# EAGLE design NixieClock (EAGLE 9.6.2)

## Sheet 1 of 4: Nixie Control And Driver
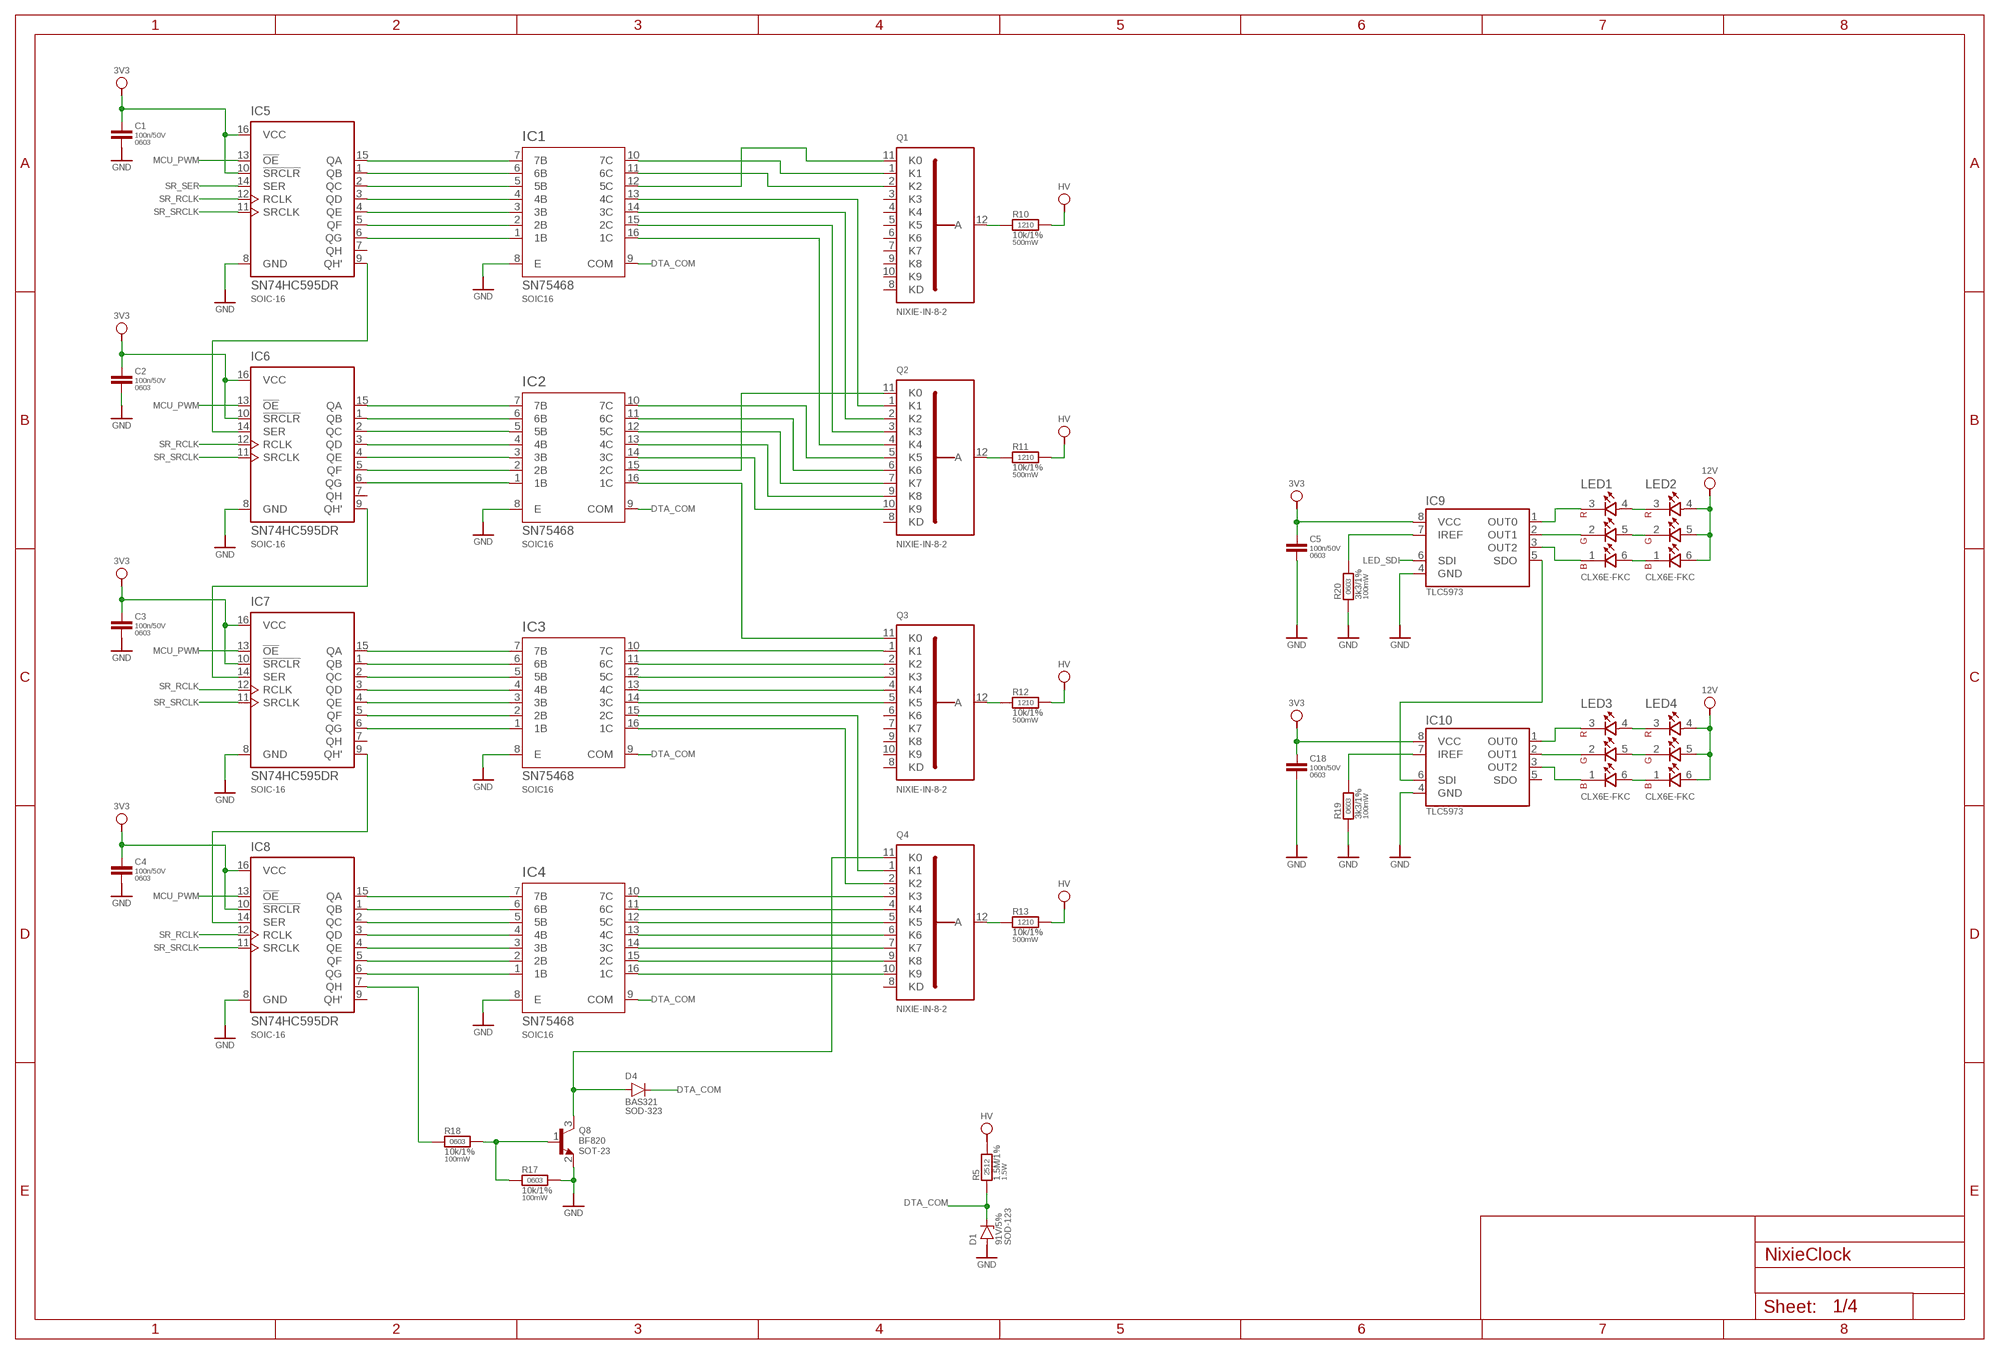
[diagram p0: schematic, sheet 1]

### Parts
C1  100n/50V  C0603C104M5RACTU  [CAPC1608X80N]
C2  100n/50V  C0603C104M5RACTU  [CAPC1608X80N]
C3  100n/50V  C0603C104M5RACTU  [CAPC1608X80N]
C4  100n/50V  C0603C104M5RACTU  [CAPC1608X80N]
C5  100n/50V  C0603C104M5RACTU  [CAPC1608X80N]
C18  100n/50V  C0603C104M5RACTU  [CAPC1608X80N]
D1  91V/5%  MMSZ5270BT1G  [SOD3716X135N]
D4  BAS321  [SOD2512X110N]
IC1  SN75468  [SOIC127P600X175-16N]
IC2  SN75468  [SOIC127P600X175-16N]
IC3  SN75468  [SOIC127P600X175-16N]
IC4  SN75468  [SOIC127P600X175-16N]
IC5  SN74HC595DR  [SOIC127P600X175-16N]
IC6  SN74HC595DR  [SOIC127P600X175-16N]
IC7  SN74HC595DR  [SOIC127P600X175-16N]
IC8  SN74HC595DR  [SOIC127P600X175-16N]
IC9  TLC5973  [SOIC127P600X175-8N]
IC10  TLC5973  [SOIC127P600X175-8N]
LED1  CLX6E-FKC  [CLX6E-FKC]
LED2  CLX6E-FKC  [CLX6E-FKC]
LED3  CLX6E-FKC  [CLX6E-FKC]
LED4  CLX6E-FKC  [CLX6E-FKC]
Q1  NIXIE-IN-8-2  [NIXIE-IN-8-2]
Q2  NIXIE-IN-8-2  [NIXIE-IN-8-2]
Q3  NIXIE-IN-8-2  [NIXIE-IN-8-2]
Q4  NIXIE-IN-8-2  [NIXIE-IN-8-2]
Q8  BF820  [SOT95P230X110-3N]
R5  1.5M/1%  MCPWR12FTEA1504  [RESC6331X65N]
R10  10k/1%  CRCW121010K0FKEA  [RESC3225X60N]
R11  10k/1%  CRCW121010K0FKEA  [RESC3225X60N]
R12  10k/1%  CRCW121010K0FKEA  [RESC3225X60N]
R13  10k/1%  CRCW121010K0FKEA  [RESC3225X60N]
R17  10k/1%  CRCW060310K0FKEA  [RESC1608X50N]
R18  10k/1%  CRCW060310K0FKEA  [RESC1608X50N]
R19  3k3/1%  MCWR06X3301FTL  [RESC1608X50N]
R20  3k3/1%  MCWR06X3301FTL  [RESC1608X50N]

### Nets
3V3: C1.1 C2.1 C3.1 C4.1 C5.1 C18.1 IC5.10(!SRCLR) IC5.16(VCC) IC6.10(!SRCLR) IC6.16(VCC) IC7.10(!SRCLR) IC7.16(VCC) IC8.10(!SRCLR) IC8.16(VCC) IC9.8(VCC) IC10.8(VCC) ; also sheet 2
12V: LED2.4(ARED) LED2.5(AGREEN) LED2.6(ABLUE) LED4.4(ARED) LED4.5(AGREEN) LED4.6(ABLUE) ; also sheet 2,3
DTA_COM: D1.1 D4.1 IC1.9(COM) IC2.9(COM) IC3.9(COM) IC4.9(COM) R5.1
GND: C1.2 C2.2 C3.2 C4.2 C5.2 C18.2 D1.2 IC1.8(E) IC2.8(E) IC3.8(E) IC4.8(E) IC5.8(GND) IC6.8(GND) IC7.8(GND) IC8.8(GND) IC9.4(GND) IC10.4(GND) Q8.2(E) R17.2 R19.1 R20.1 ; also sheet 2,3,4
HV: R5.2 R10.2 R11.2 R12.2 R13.2 ; also sheet 3
LED_SDI: IC9.6(SDI) ; also sheet 2
MCU_PWM: IC5.13(!OE) IC6.13(!OE) IC7.13(!OE) IC8.13(!OE) ; also sheet 2
N$1: IC1.7(7B) IC5.15(QA)
N$2: IC1.6(6B) IC5.1(QB)
N$3: IC1.5(5B) IC5.2(QC)
N$4: IC1.4(4B) IC5.3(QD)
N$5: IC1.3(3B) IC5.4(QE)
N$6: IC1.2(2B) IC5.5(QF)
N$7: IC1.1(1B) IC5.6(QG)
N$8: IC5.9(QH') IC6.14(SER)
N$9: IC1.10(7C) Q1.1(K1)
N$10: IC1.11(6C) Q1.2(K2)
N$11: IC1.12(5C) Q1.11(K0)
N$12: IC1.13(4C) Q2.1(K1)
N$13: IC1.14(3C) Q2.2(K2)
N$14: IC1.15(2C) Q2.3(K3)
N$15: IC1.16(1C) Q2.4(K4)
N$16: IC6.9(QH') IC7.14(SER)
N$17: IC2.10(7C) Q2.5(K5)
N$18: IC2.11(6C) Q2.6(K6)
N$19: IC2.12(5C) Q2.7(K7)
N$20: IC2.13(4C) Q2.9(K8)
N$21: IC2.14(3C) Q2.10(K9)
N$22: IC2.15(2C) Q2.11(K0)
N$23: IC2.7(7B) IC6.15(QA)
N$24: IC7.9(QH') IC8.14(SER)
N$25: IC2.6(6B) IC6.1(QB)
N$26: IC2.5(5B) IC6.2(QC)
N$27: IC2.4(4B) IC6.3(QD)
N$28: IC2.3(3B) IC6.4(QE)
N$29: IC2.2(2B) IC6.5(QF)
N$30: IC2.1(1B) IC6.6(QG)
N$31: IC3.7(7B) IC7.15(QA)
N$32: IC3.6(6B) IC7.1(QB)
N$33: IC3.5(5B) IC7.2(QC)
N$34: IC3.4(4B) IC7.3(QD)
N$35: IC3.3(3B) IC7.4(QE)
N$36: IC3.2(2B) IC7.5(QF)
N$37: IC3.1(1B) IC7.6(QG)
N$38: IC8.7(QH) R18.1
N$39: IC9.1(OUT0) LED1.3(CRED)
N$40: IC9.3(OUT2) LED1.1(CBLUE)
N$41: IC9.2(OUT1) LED1.2(CGREEN)
N$42: IC4.11(6C) Q4.4(K4)
N$43: IC10.1(OUT0) LED3.3(CRED)
N$44: IC4.7(7B) IC8.15(QA)
N$45: IC4.6(6B) IC8.1(QB)
N$46: IC4.5(5B) IC8.2(QC)
N$47: IC4.4(4B) IC8.3(QD)
N$48: IC4.3(3B) IC8.4(QE)
N$49: IC4.2(2B) IC8.5(QF)
N$50: IC4.1(1B) IC8.6(QG)
N$51: IC2.16(1C) Q3.11(K0)
N$52: IC3.14(3C) Q3.5(K5)
N$53: IC3.13(4C) Q3.4(K4)
N$54: IC3.12(5C) Q3.3(K3)
N$55: Q1.12(A) R10.1
N$57: IC3.11(6C) Q3.2(K2)
N$58: IC3.10(7C) Q3.1(K1)
N$59: IC3.15(2C) Q4.1(K1)
N$60: IC3.16(1C) Q4.2(K2)
N$61: IC4.10(7C) Q4.3(K3)
N$62: IC4.12(5C) Q4.5(K5)
N$63: IC4.13(4C) Q4.6(K6)
N$64: IC4.14(3C) Q4.7(K7)
N$65: Q8.1(B) R17.1 R18.2
N$66: IC4.15(2C) Q4.9(K8)
N$67: IC4.16(1C) Q4.10(K9)
N$68: D4.2 Q4.11(K0) Q8.3(C)
N$69: IC10.2(OUT1) LED3.2(CGREEN)
N$73: IC10.3(OUT2) LED3.1(CBLUE)
N$74: Q2.12(A) R11.1
N$75: Q3.12(A) R12.1
N$76: Q4.12(A) R13.1
N$82: LED3.4(ARED) LED4.3(CRED)
N$84: LED3.5(AGREEN) LED4.2(CGREEN)
N$85: LED3.6(ABLUE) LED4.1(CBLUE)
N$86: LED1.4(ARED) LED2.3(CRED)
N$87: LED1.5(AGREEN) LED2.2(CGREEN)
N$88: LED1.6(ABLUE) LED2.1(CBLUE)
N$90: IC9.7(IREF) R20.2
N$91: IC10.7(IREF) R19.2
N$93: IC9.5(SDO) IC10.6(SDI)
SR_RCLK: IC5.12(RCLK) IC6.12(RCLK) IC7.12(RCLK) IC8.12(RCLK) ; also sheet 2
SR_SER: IC5.14(SER) ; also sheet 2
SR_SRCLK: IC5.11(SRCLK) IC6.11(SRCLK) IC7.11(SRCLK) IC8.11(SRCLK) ; also sheet 2
Unconnected: IC5.7(QH) IC6.7(QH) IC7.7(QH) IC8.9(QH') IC10.5(SDO) Q1.3(K3) Q1.4(K4) Q1.5(K5) Q1.6(K6) Q1.7(K7) Q1.8(KD) Q1.9(K8) Q1.10(K9) Q2.8(KD) Q3.6(K6) Q3.7(K7) Q3.8(KD) Q3.9(K8) Q3.10(K9) Q4.8(KD)

## Sheet 2 of 4: MCU And Connectors
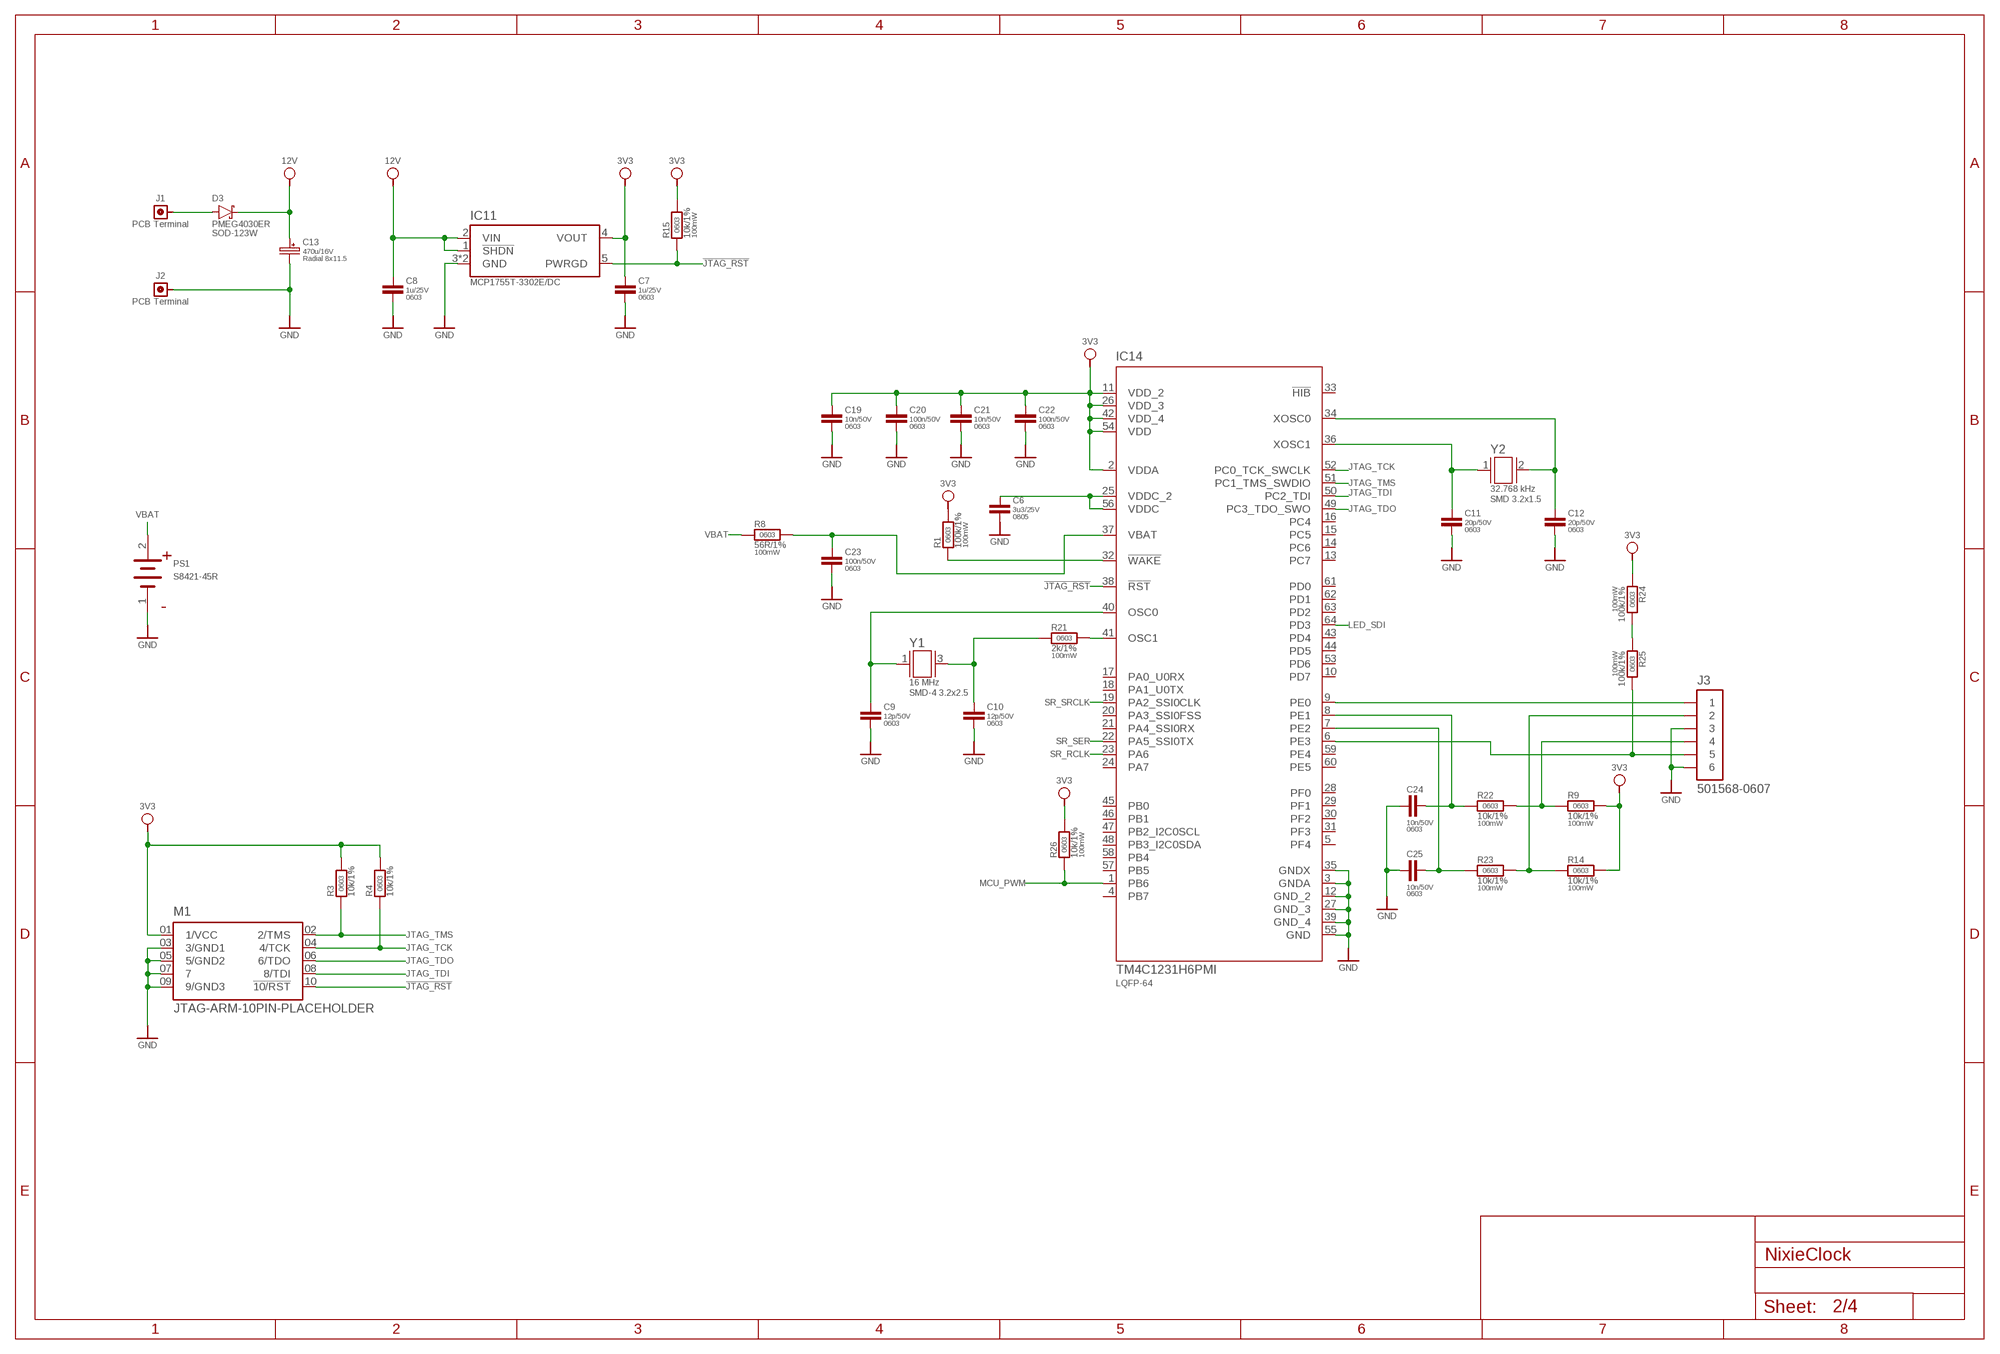
[diagram p1: schematic, sheet 2]

### Parts
C6  3u3/25V  C2012X7R1E335K125  [CAPC2012X145N]
C7  1u/25V  CL10A105KA8NNNC  [CAPC1608X80N]
C8  1u/25V  CL10A105KA8NNNC  [CAPC1608X80N]
C9  12p/50V  C0603C120J5GACTU  [CAPC1608X80N]
C10  12p/50V  C0603C120J5GACTU  [CAPC1608X80N]
C11  20p/50V  C0603C200J1GACTU  [CAPC1608X80N]
C12  20p/50V  C0603C200J1GACTU  [CAPC1608X80N]
C13  470u/16V  ECA1CM471  [CAPPRD350W60D800H1150B]
C19  10n/50V  C0603C103K5RACTU  [CAPC1608X80N]
C20  100n/50V  C0603C104M5RACTU  [CAPC1608X80N]
C21  10n/50V  C0603C103K5RACTU  [CAPC1608X80N]
C22  100n/50V  C0603C104M5RACTU  [CAPC1608X80N]
C23  100n/50V  C0603C104M5RACTU  [CAPC1608X80N]
C24  10n/50V  C0603C103K5RACTU  [CAPC1608X80N]
C25  10n/50V  C0603C103K5RACTU  [CAPC1608X80N]
D3  PMEG4030ER  PMEG4010CEJ  [SODFL3517X110N]
IC11  MCP1755T-3302E/DC  [SOT127P700X180-6N]
IC14  TM4C1231H6PMI  [QFP50P1200X1200X160-64N]
J1  PCB Terminal  PCB_TERMINAL_PAD  [PCB_TERMINAL_PAD]
J2  PCB Terminal  PCB_TERMINAL_PAD  [PCB_TERMINAL_PAD]
J3  501568-0607  MOLEX_501568-0607  [MOLEX_501568-0607]
M1  JTAG-ARM-10PIN-PLACEHOLDER  [JTAG-ARM-10PIN-PLACEHOLDER]
PS1  S8421-45R  [S8421-45R]
R1  100k/1%  CRCW0603100KFKEA  [RESC1608X50N]
R3  10k/1%  CRCW060310K0FKEA  [RESC1608X50N]
R4  10k/1%  CRCW060310K0FKEA  [RESC1608X50N]
R8  56R/1%  CRCW060356R0FKEA  [RESC1608X50N]
R9  10k/1%  CRCW060310K0FKEA  [RESC1608X50N]
R14  10k/1%  CRCW060310K0FKEA  [RESC1608X50N]
R15  10k/1%  CRCW060310K0FKEA  [RESC1608X50N]
R21  2k/1%  CRCW06032K00FKEA  [RESC1608X50N]
R22  10k/1%  CRCW060310K0FKEA  [RESC1608X50N]
R23  10k/1%  CRCW060310K0FKEA  [RESC1608X50N]
R24  100k/1%  CRCW0603100KFKEA  [RESC1608X50N]
R25  100k/1%  CRCW0603100KFKEA  [RESC1608X50N]
R26  10k/1%  CRCW060310K0FKEA  [RESC1608X50N]
Y1  16 MHz  MCSJK-7U-16.00-10-10-80-B-10  [OSCCC320X250X100N]
Y2  32.768 kHz  ABS07AIG-32.768KHZ-1-T  [OSCCC320X150X90N]

### Nets
3V3: C7.1 C19.1 C20.1 C21.1 C22.1 IC11.4(VOUT) IC14.2(VDDA) IC14.11(VDD_2) IC14.26(VDD_3) IC14.42(VDD_4) IC14.54(VDD) M1.01(1/VCC) R1.2 R3.2 R4.2 R9.2 R14.2 R15.2 R24.1 R26.2 ; also sheet 1
12V: C8.1 C13.1 D3.1 IC11.1(!SHDN) IC11.2(VIN) ; also sheet 1,3
!JTAG_RST: IC11.5(PWRGD) IC14.38(!RST) M1.10(!10/RST) R15.1
!WAKE: IC14.32(!WAKE) R1.1
GND: C6.2 C7.2 C8.2 C9.2 C10.2 C11.2 C12.2 C13.2 C19.2 C20.2 C21.2 C22.2 C23.2 C24.1 C25.1 IC11.3(GND) IC11.6(GND) IC14.3(GNDA) IC14.12(GND_2) IC14.27(GND_3) IC14.35(GNDX) IC14.39(GND_4) IC14.55(GND) J2.1 J3.3 J3.6 M1.03(3/GND1) M1.05(5/GND2) M1.07 M1.09(9/GND3) PS1.1(CATHODE) ; also sheet 1,3,4
JTAG_TCK: IC14.52(PC0_TCK_SWCLK) M1.04(4/TCK) R4.1
JTAG_TDI: IC14.50(PC2_TDI) M1.08(8/TDI)
JTAG_TDO: IC14.49(PC3_TDO_SWO) M1.06(6/TDO)
JTAG_TMS: IC14.51(PC1_TMS_SWDIO) M1.02(2/TMS) R3.1
LED_SDI: IC14.64(PD3) ; also sheet 1
MCU_LS: IC14.6(PE3) J3.5 R25.2
MCU_PWM: IC14.1(PB6) R26.1 ; also sheet 1
MCU_QEA: C24.2 IC14.8(PE1) R22.1
MCU_QEB: C25.2 IC14.7(PE2) R23.1
MCU_SW: IC14.9(PE0) J3.1
MCU_VBAT: C23.1 IC14.37(VBAT) R8.2
MCU_VDDC: C6.1 IC14.25(VDDC_2) IC14.56(VDDC)
N$71: R24.2 R25.1
N$89: IC14.41(OSC1) R21.2
OSC0: C9.1 IC14.40(OSC0) Y1.1
OSC1: C10.1 R21.1 Y1.3
QEA_RAW: J3.4 R9.1 R22.2
QEB_RAW: J3.2 R14.1 R23.2
SR_RCLK: IC14.23(PA6) ; also sheet 1
SR_SER: IC14.22(PA5_SSI0TX) ; also sheet 1
SR_SRCLK: IC14.19(PA2_SSI0CLK) ; also sheet 1
VBAT: PS1.2(ANODE) R8.1
VSUPP [Supply]: D3.2 J1.1
XOSC0: C12.1 IC14.34(XOSC0) Y2.2
XOSC1: C11.1 IC14.36(XOSC1) Y2.1
Unconnected: IC14.4(PB7) IC14.5(PF4) IC14.10(PD7) IC14.13(PC7) IC14.14(PC6) IC14.15(PC5) IC14.16(PC4) IC14.17(PA0_U0RX) IC14.18(PA1_U0TX) IC14.20(PA3_SSI0FSS) IC14.21(PA4_SSI0RX) IC14.24(PA7) IC14.28(PF0) IC14.29(PF1) IC14.30(PF2) IC14.31(PF3) IC14.33(!HIB) IC14.43(PD4) IC14.44(PD5) IC14.45(PB0) IC14.46(PB1) IC14.47(PB2_I2C0SCL) IC14.48(PB3_I2C0SDA) IC14.53(PD6) IC14.57(PB5) IC14.58(PB4) IC14.59(PE4) IC14.60(PE5) IC14.61(PD0) IC14.62(PD1) IC14.63(PD2)

## Sheet 3 of 4: High Voltage Supply
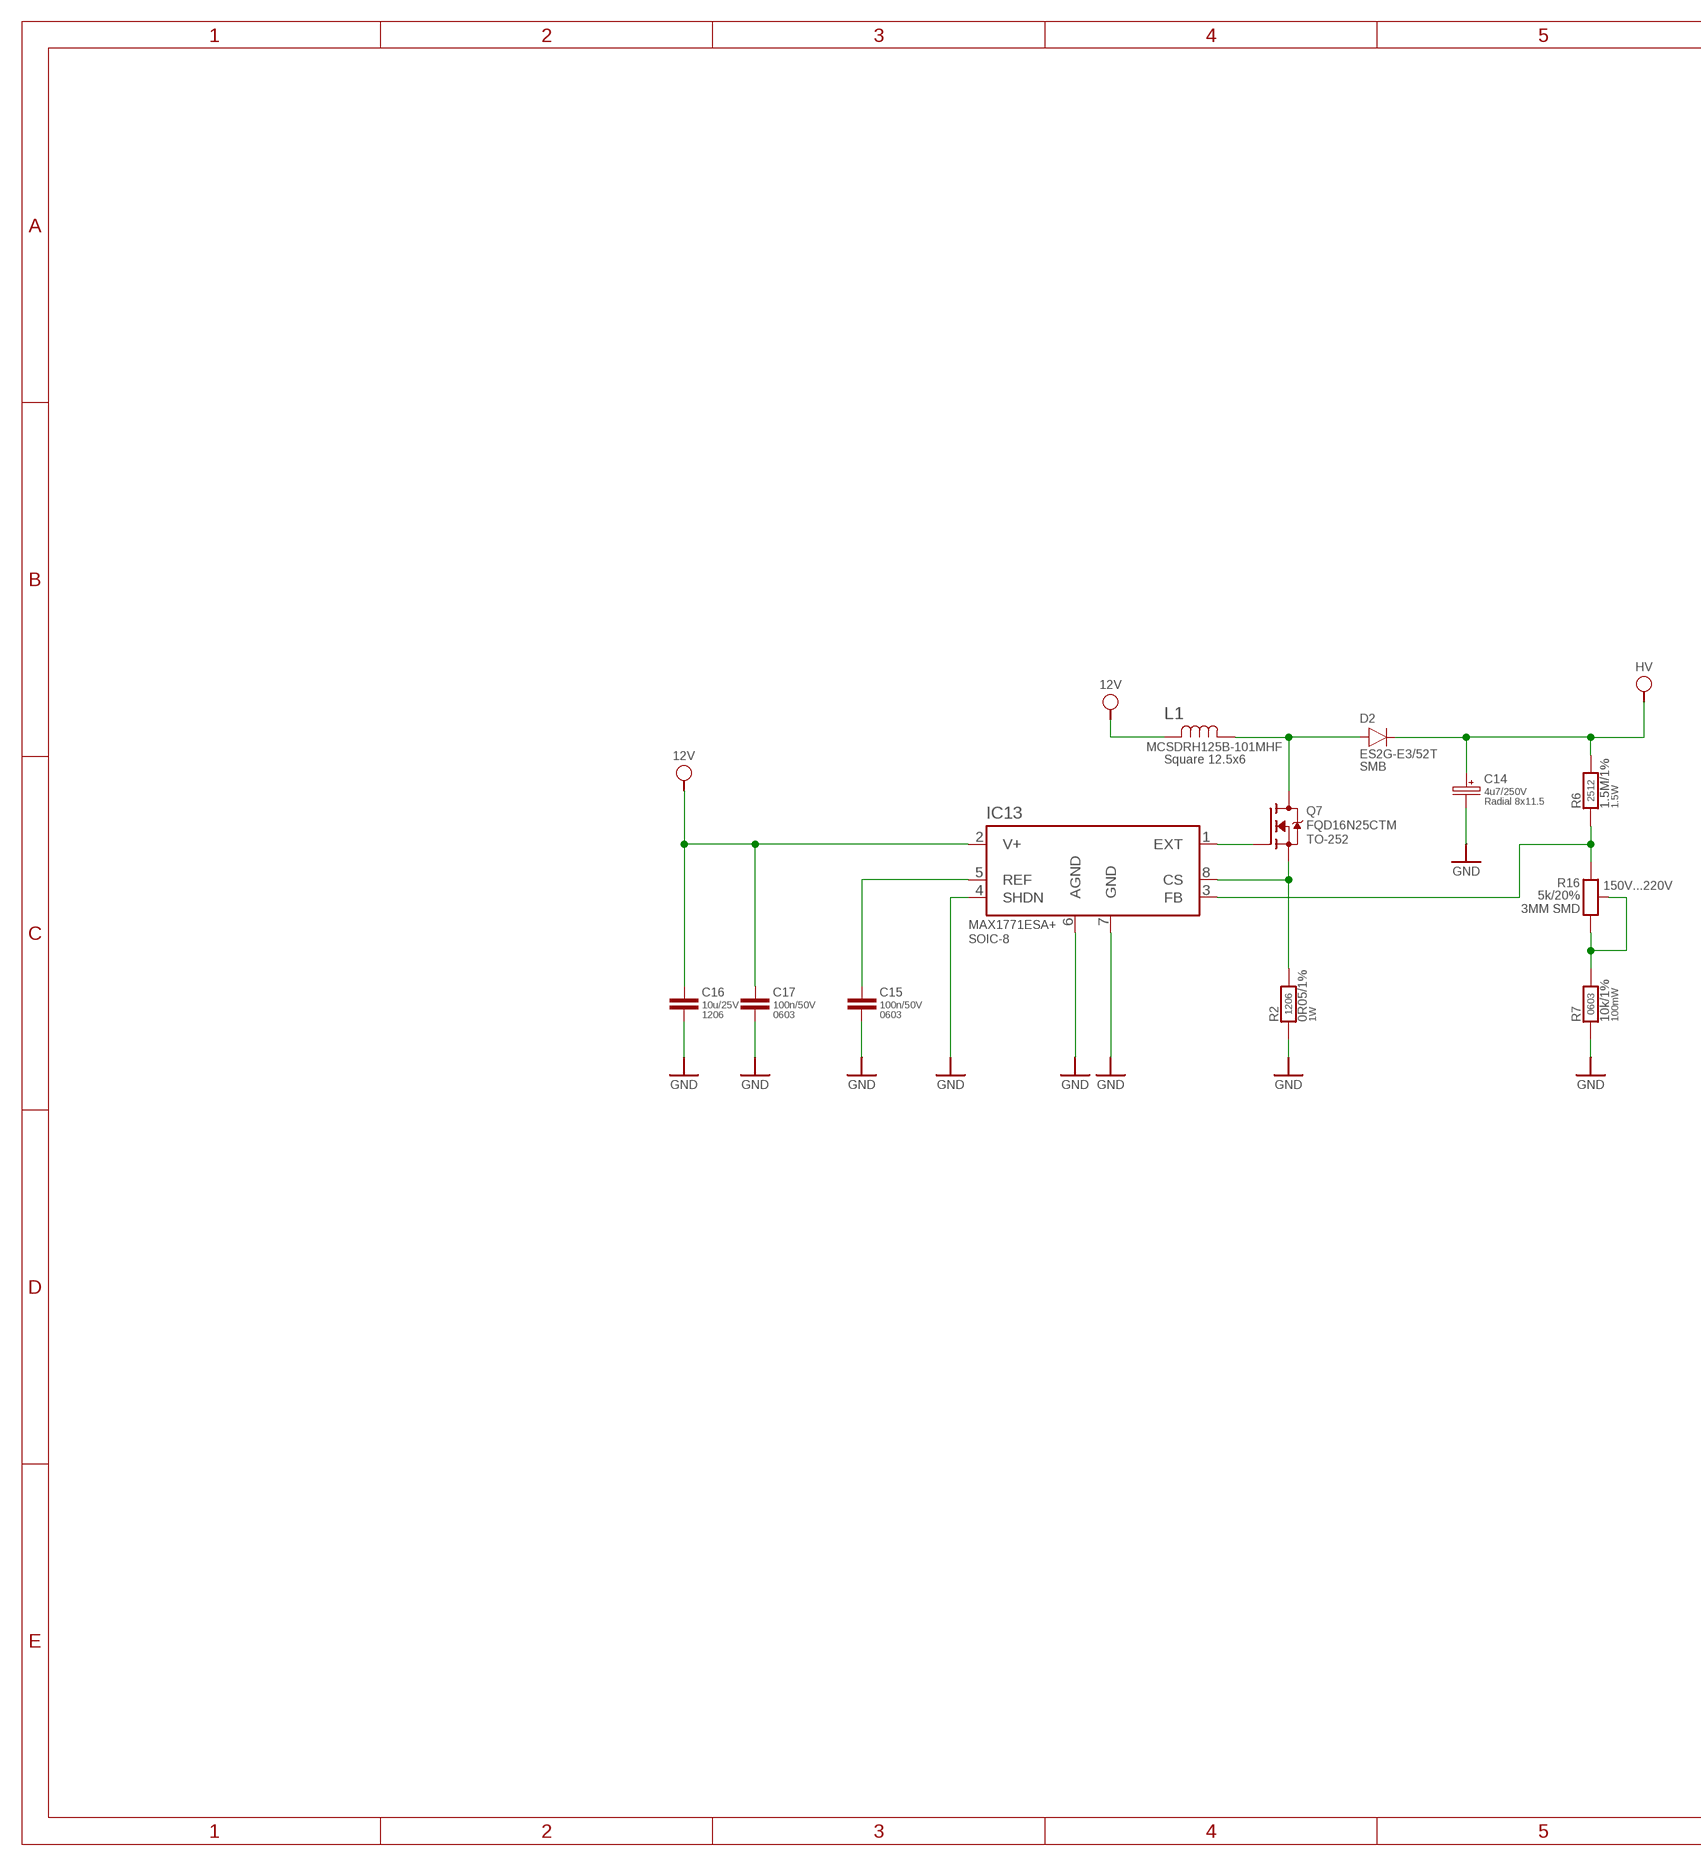
[diagram p2: schematic, sheet 3, part 1 of 2]
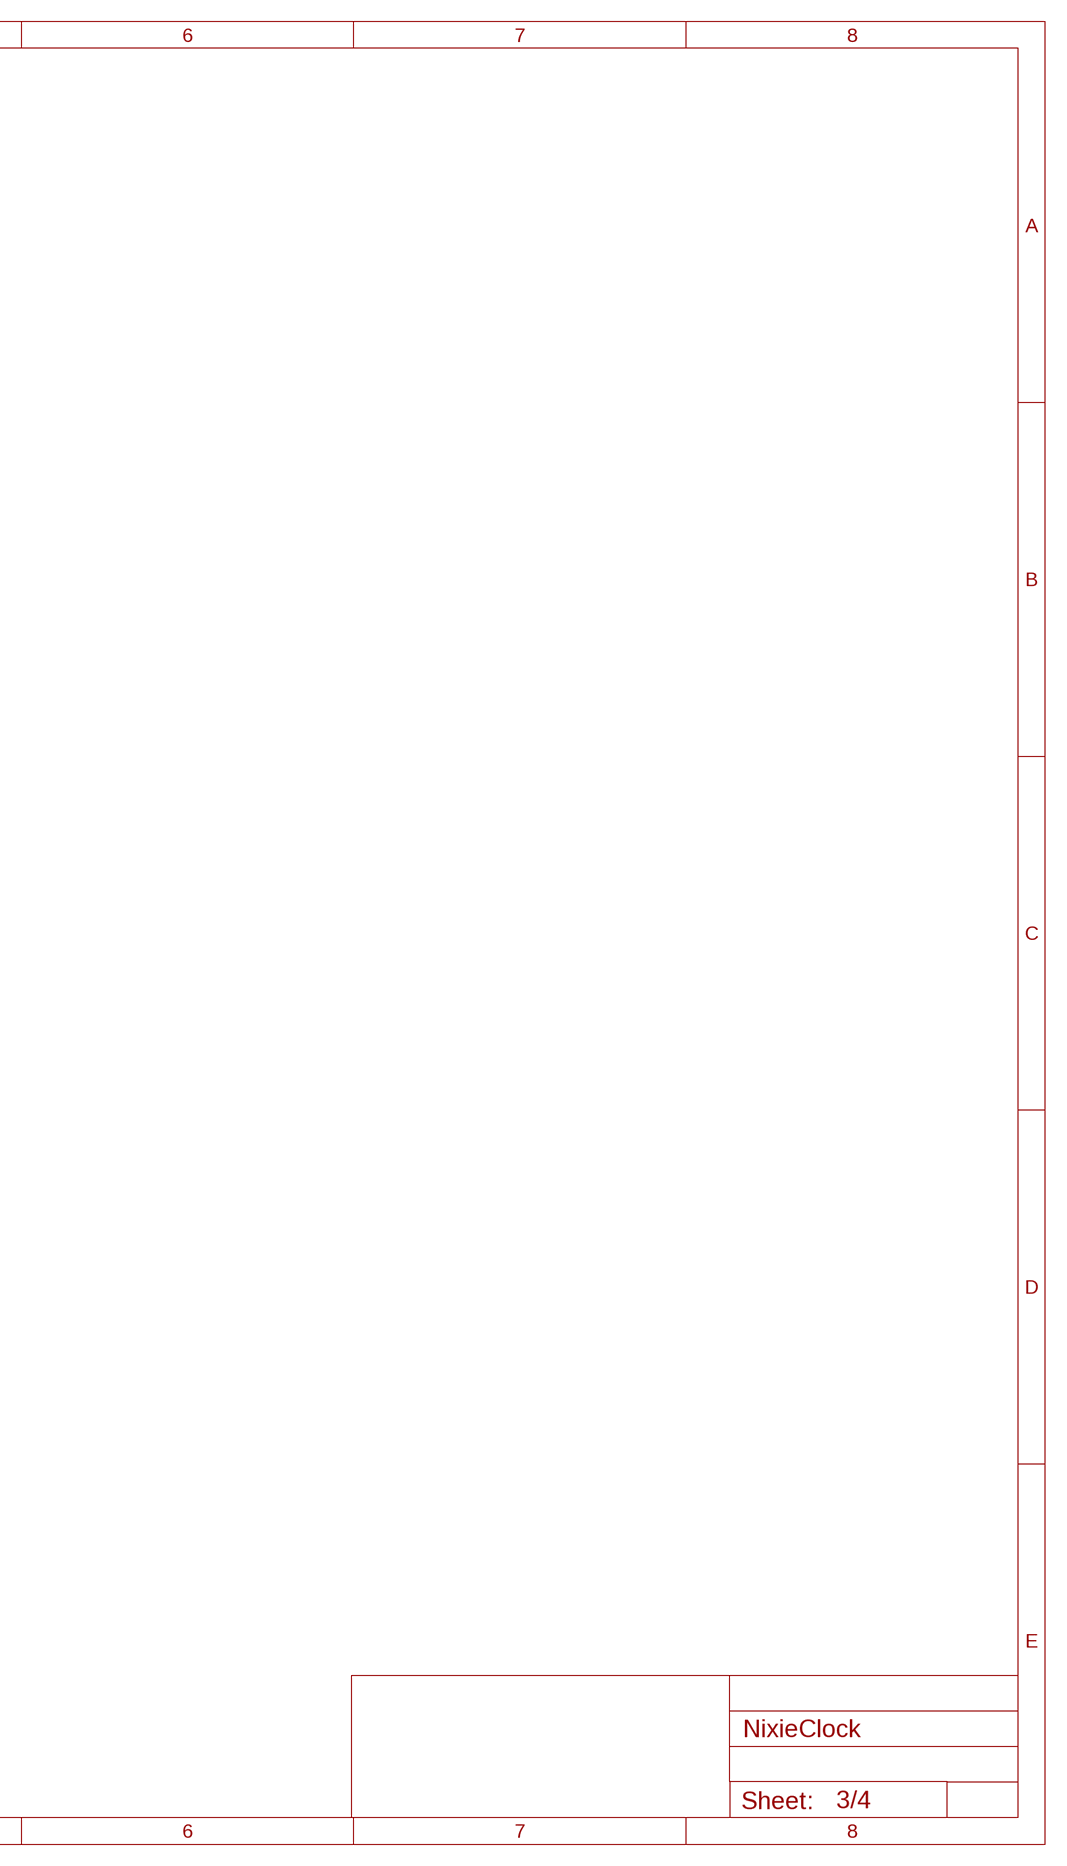
[diagram p3: schematic, sheet 3, part 2 of 2]

### Parts
C14  4u7/250V  ECA2EHG4R7  [CAPPRD350W60D800H1150B]
C15  100n/50V  C0603C104M5RACTU  [CAPC1608X80N]
C16  10u/25V  C1206C106K3PACTU  [CAPC3216X170N]
C17  100n/50V  C0603C104M5RACTU  [CAPC1608X80N]
D2  ES2G-E3/52T  [DIOM5436X245N]
IC13  MAX1771ESA+  [SOIC127P600X175-8N]
L1  MCSDRH125B-101MHF  [INDM120120X600N]
Q7  FQD16N25CTM  [TO230P990X240-3N]
R2  0R05/1%  ERJ8CWFR050V  [RESC3216X70N]
R6  1.5M/1%  MCPWR12FTEA1504  [RESC6331X65N]
R7  10k/1%  CRCW060310K0FKEA  [RESC1608X50N]
R16  5k/20%  22AR5K  [22A]

### Nets
12V: C16.1 C17.1 IC13.2(V+) L1.1 ; also sheet 1,2
CS: IC13.8(CS) Q7.3(S) R2.2
FB: IC13.3(FB) R6.1 R16.P$1
GND: C14.2 C15.2 C16.2 C17.2 IC13.4(SHDN) IC13.6(AGND) IC13.7(GND) R2.1 R7.1 ; also sheet 1,2,4
HV: C14.1 D2.1 R6.2 ; also sheet 1
N$56: IC13.1(EXT) Q7.1(G)
N$83: R7.2 R16.P$2 R16.P$3
REF: C15.1 IC13.5(REF)
SW: D2.2 L1.2 Q7.4(D)

### Notes on the sheet
- 150V...220V

## Sheet 4 of 4: Miscellaneous
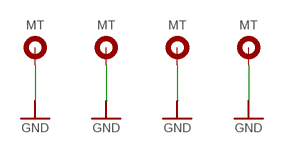
[diagram p4: schematic, sheet 4]

### Parts
MT1  MOUNTING_HOLE_3MM  [MOUNTING_HOLE_3MM]
MT2  MOUNTING_HOLE_3MM  [MOUNTING_HOLE_3MM]
MT3  MOUNTING_HOLE_3MM  [MOUNTING_HOLE_3MM]
MT4  MOUNTING_HOLE_3MM  [MOUNTING_HOLE_3MM]

### Nets
GND: MT1.0(GND) MT1.1(GND) MT1.2(GND) MT1.3(GND) MT1.4(GND) MT1.5(GND) MT1.6(GND) MT1.7(GND) MT1.8(GND) MT2.0(GND) MT2.1(GND) MT2.2(GND) MT2.3(GND) MT2.4(GND) MT2.5(GND) MT2.6(GND) MT2.7(GND) MT2.8(GND) MT3.0(GND) MT3.1(GND) MT3.2(GND) MT3.3(GND) MT3.4(GND) MT3.5(GND) MT3.6(GND) MT3.7(GND) MT3.8(GND) MT4.0(GND) MT4.1(GND) MT4.2(GND) MT4.3(GND) MT4.4(GND) MT4.5(GND) MT4.6(GND) MT4.7(GND) MT4.8(GND) ; also sheet 1,2,3

## Library data of the parts
C1-C5 C15 C17 C18 C20 C22 C23 = Capacitors:C0603C104M5RACTU: SMT Capacitor, 100n/50V, X7R, 10%, 0603, KEMET; MANUFACTURER: KEMET; PACKAGE: 0603; PARAMETER: X7R, 20%; PARTNUMBER: C0603C104M5RACTU
C6 = Capacitors:C2012X7R1E335K125: SMT Capacitor, 3u3/25V, X7R, 10%, 0805, TDK; MANUFACTURER: TDK; PACKAGE: 0805; PARAMETER: X7R, 10%; PARTNUMBER: C2012X7R1E335K125AB
C7 C8 = Capacitors:CL10A105KA8NNNC: SMT Capacitor, 1u/25V, X7R, 10%, 0603, SAMSUNG ELECTRO-MECHANICS; MANUFACTURER: SAMSUNG ELECTRO-MECHANICS; PACKAGE: 0603; PARAMETER: X7R, 10%; PARTNUMBER: CL10A105KA8NNNC
C9 C10 = Capacitors:C0603C120J5GACTU: SMT Capacitor, 12p/50V, C0G/NP0, ±5%, 0603, KEMET; MANUFACTURER: KEMET; PACKAGE: 0603; PARAMETER: C0G/NP0, ±5%; PARTNUMBER: C0603C120J5GACTU
C11 C12 = Capacitors:C0603C200J1GACTU: SMT Capacitor, 20p/50V, C0G/NP0, ±5%, 0603, KEMET; MANUFACTURER: KEMET; PACKAGE: 0603; PARAMETER: C0G/NP0, ±5%; PARTNUMBER: C0603C200J1GACTU
C13 = Capacitors:ECA1CM471: Electrolytic Capacitor, 470 µF, 16 V, ± 20%, Radial Leaded, Panasonic; MANUFACTURER: Panasonic; PACKAGE: Radial 8x11.5; PARAMETER: Alu, 20%; PARTNUMBER: ECA1CM471
C14 = Capacitors:ECA2EHG4R7: Electrolytic Capacitor, 4.7 µF, 250 V, ± 20%, Radial Leaded, Panasonic; MANUFACTURER: Panasonic; PACKAGE: Radial 8x11.5; PARAMETER: Alu, 20%; PARTNUMBER: ECA2EHG4R7
C16 = Capacitors:C1206C106K3PACTU: SMT Capacitor, 10u/25V, X5R, ±10%, 1206, KEMET; MANUFACTURER: KEMET; PACKAGE: 1206; PARAMETER: X5R; PARTNUMBER: C1206C106K3PACTU
C19 C21 C24 C25 = Capacitors:C0603C103K5RACTU: SMT Capacitor, 10n/50V, X7R, 10%, 0603, KEMET; MANUFACTURER: KEMET; PACKAGE: 0603; PARAMETER: X7R, 10%; PARTNUMBER: C0603C103K5RACTU
D1 = Diodes:MMSZ5270BT1G: Zener Diode, Voltage Regulator, 91 V, 500 mW, 5 %, SOD-123, ON Semiconductor; MANUFACTURER: ON Semiconductor; PACKAGE: SOD-123; PARAMETER: 500mW; PARTNUMBER: MMSZ5270BT1G
D2 = Diodes:ES2G-E3/52T: Fast / Ultrafast Diode, 400 V, 2 A, 900 mV, 35 ns, 50 A, SMB, VISHAY; MANUFACTURER: VISHAY; PACKAGE: SMB; PARAMETER: 400V/2A; PARTNUMBER: ES2G-E3/52T
D3 = Diodes:PMEG4010CEJ: Schottky Rectifier, 40 V, 3 A, 540 mV, SOD-123W, NEXPERIA; MANUFACTURER: NEXPERIA; PACKAGE: SOD-123W; PARAMETER: 40V, 3A; PARTNUMBER: PMEG4030ER,115
D4 = Diodes:BAS321: Small Signal Diode, 250 V, 250 mA, 1.25 V, 50 ns, 9 A; MANUFACTURER: NEXPERIA; PACKAGE: SOD-323; PARAMETER: 250V, 250mA; PARTNUMBER: BAS321/8F
IC1-IC4 = ICs:SN75468: 100-V, 7-ch darlington array with TTL or CMOS compatibility; MANUFACTURER: Texas Instruments; PACKAGE: SOIC16; PARTNUMBER: SN75468D
IC5-IC8 = ICs:SN74HC595DR: 8-Bit Shift Register With 3-State Outputs; MANUFACTURER: Texas Instruments; PACKAGE: SOIC-16; PARTNUMBER: SN74HC595DR
IC9 IC10 = ICs:TLC5973: LED Driver, 3-Channel, 12-Bit, PWM Constant-Current with Single-Wire Interface, Texas Instruments; MANUFACTURER: Texas Instruments; PACKAGE: SOIC-8; PARTNUMBER: TLC5973
IC11 = ICs:MCP1755T-3302E/DC: Fixed LDO Voltage Regulator, 3.6V to 16V, 300mV Dropout, 3.3Vout, 300mAout, SOT-223-5, MICROCHIP; MANUFACTURER: MICROCHIP; PACKAGE: SOT-223-5; PARTNUMBER: MCP1755T-3302E/DC
IC13 = ICs:MAX1771ESA+: DC/DC Controller, Boost (Step Up), 3 V to 16.5 V, 1 Output, 300 kHz, SOIC-8; MANUFACTURER: Maxim Integrated; PACKAGE: SOIC-8; PARTNUMBER: MAX1771ESA+
IC14 = ICs:TM4C1231H6PMI; MANUFACTURER: Texas Instruments; PACKAGE: LQFP-64; PARTNUMBER: TM4C1231H6PMI
J1 J2 = Connectors:PCB_TERMINAL_PAD; PARAMETER: 4mmx2mm
J3 = Connectors:MOLEX_501568-0607: PCB Header, 1.00mm Pitch, Pico-Clasp, Single Row, Right-Angle, Surface Mount, Tin Plated, with Inner Positive Lock, 6 Circuits; MANUFACTURER: MOLEX; PARTNUMBER: 501568-0607
L1 = Inductors:MCSDRH125B-101MHF: Power Inductor (SMD), 100 µH, 2.4 A, Shielded, 2.2 A, MCSDRH125B Series, 12.5mm x 12.5mm x 6mm; MANUFACTURER: Multicomp PRO; PACKAGE: Square 12.5x6; PARTNUMBER: MCSDRH125B-101MHF
LED1-LED4 = Diodes:CLX6E-FKC: LED, Red, Green, Blue, SMD, Square, R 15mA, G 10mA, B 10mA, CREE; MANUFACTURER: CREE; PACKAGE: SMD 3.5x3.4x2.8 mm; PARTNUMBER: CLX6E-FKC-CH1M1D1BB7C3D3
M1 = Connectors:JTAG-ARM-10PIN-PLACEHOLDER: JTAG 10-pin ARM compatible connector placeholder.
MT1-MT4 = Misc:MOUNTING_HOLE_3MM
PS1 = Misc:S8421-45R: Battery Holder (Open) Coin, 20.0mm 1 Cell SMD (SMT) Tab; MANUFACTURER: Harwin; PARTNUMBER: S8421-45R
Q1-Q4 = Misc:NIXIE-IN-8-2
Q7 = Transistors:FQD16N25CTM: Power MOSFET, N Channel, 250 V, 16 A, 0.22 ohm, TO-252 (DPAK), Surface Mount; MANUFACTURER: ON Semiconductor; PACKAGE: TO-252; PARTNUMBER: FQD16N25CTM
Q8 = Transistors:BF820: NPN Transistor, Bipolar (BJT), 300 V, 50 mA, 250 mW, SOT-23, NEXPERIA; MANUFACTURER: NEXPERIA; PACKAGE: SOT-23; PARTNUMBER: BF820
R1 R24 R25 = Resistors:CRCW0603100KFKEA: SMT Resistor, 100k/1%, 100mW, 0603, VISHAY; MANUFACTURER: VISHAY; PACKAGE: 0603; PARAMETER: 100mW; PARTNUMBER: CRCW0603100KFKEA
R2 = Resistors:ERJ8CWFR050V: SMD Current Sense Resistor, 0R05/1%, 1 W, 1206 [3216], Panasonic; MANUFACTURER: Panasonic; PACKAGE: 1206; PARAMETER: 1W; PARTNUMBER: ERJ8CWFR050V
R3 R4 R7 R9 R14 R15 R17 R18 R22 R23 R26 = Resistors:CRCW060310K0FKEA: SMT Resistor, 10k/1%, 100mW, 0603, VISHAY; MANUFACTURER: VISHAY; PACKAGE: 0603; PARAMETER: 100mW; PARTNUMBER: CRCW060310K0FKEA
R5 R6 = Resistors:MCPWR12FTEA1504: SMT Resistor, 1.5M, 1%, 1.5W, 2512 [6432], MULTICOMP PRO; MANUFACTURER: MULTICOMP PRO; PACKAGE: 2512; PARAMETER: 1.5W; PARTNUMBER: MCPWR12FTEA1504
R8 = Resistors:CRCW060356R0FKEA: SMT Resistor, 56R/1%, 100mW, 0603, VISHAY; MANUFACTURER: VISHAY; PACKAGE: 0603; PARAMETER: 100mW; PARTNUMBER: CRCW060333R0FKEA
R10-R13 = Resistors:CRCW121010K0FKEA: SMT Resistor, 10k/1%, 500mW, 1210, VISHAY; MANUFACTURER: VISHAY; PACKAGE: 1210; PARAMETER: 500mW; PARTNUMBER: CRCW121010K0FKEA
R16 = Resistors:22AR5K: Trimpot, Single Turn, Cermet, Top Adjust, 5 kohm, Surface Mount, 1 Turns; MANUFACTURER: TT ELECTRONICS / BI TECHNOL; PACKAGE: 3MM SMD
R19 R20 = Resistors:MCWR06X3301FTL: SMT Resistor, 3k3/1%, 100mW, 0603, MULTICOMP PRO; MANUFACTURER: MULTICOMP PRO; PACKAGE: 0603; PARAMETER: 100mW; PARTNUMBER: MCWR06X3301FTL
R21 = Resistors:CRCW06032K00FKEA: SMT Resistor, 2k/1%, 100mW, 0603, VISHAY; MANUFACTURER: VISHAY; PACKAGE: 0603; PARAMETER: 100mW; PARTNUMBER: CRCW06032K00FKEA
Y1 = Crystals:MCSJK-7U-16.00-10-10-80-B-10: SMT Crystal, 16 MHz, SMD, 3.2mm x 2.5mm, 10 ppm, 10 pF, 10 ppm; MANUFACTURER: ABRACON; PACKAGE: SMD-4 3.2x2.5; PARAMETER: ±10ppm, 10pF; PARTNUMBER: MCSJK-7U-16.00-10-10-80-B-10
Y2 = Crystals:ABS07AIG-32.768KHZ-1-T: SMT Crystal, 32.768 kHz, SMD, 3.2mm x 1.5mm, 12.5 pF, 10 ppm; MANUFACTURER: ABRACON; PACKAGE: SMD 3.2x1.5; PARAMETER: ±10 ppm, 12.5 pF; PARTNUMBER: ABS07AIG-32.768KHZ-1-T

## Net classes
1 Supply: width 1 mm

## Board
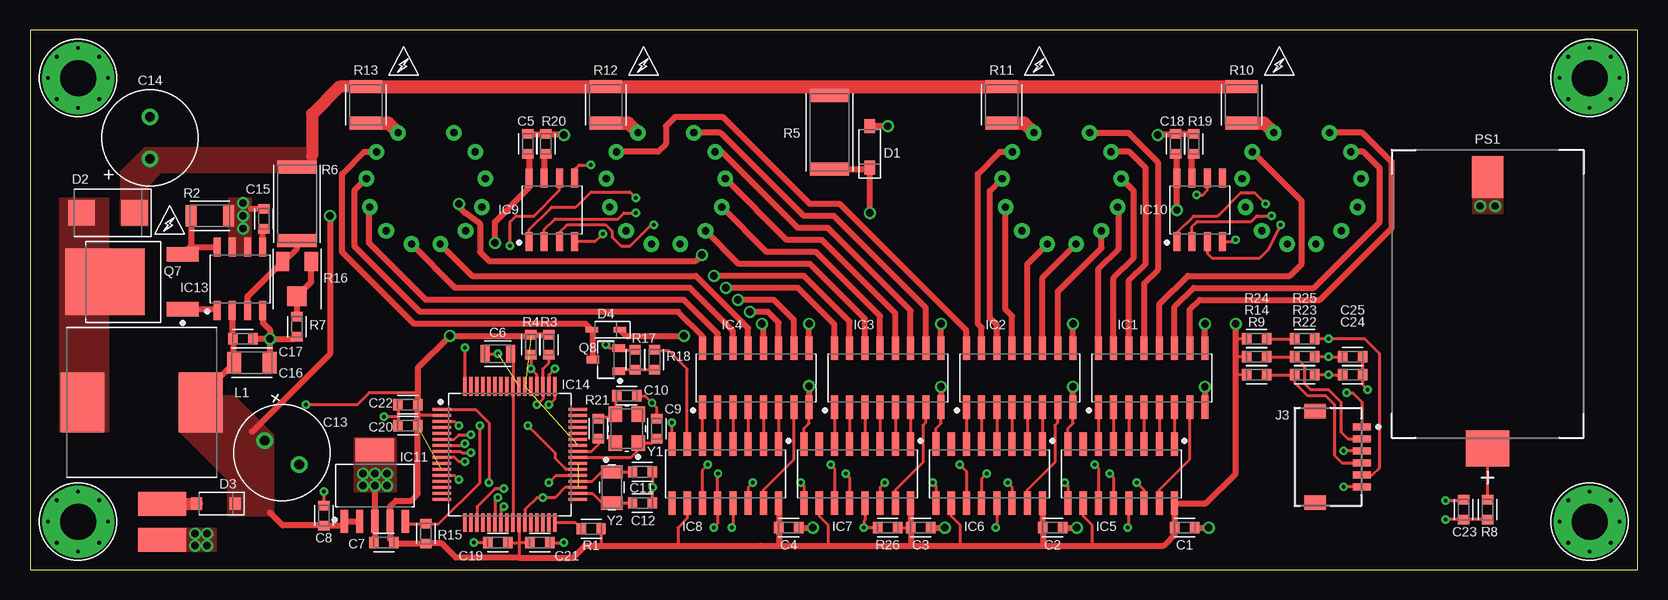
[diagram p5: board, top side]
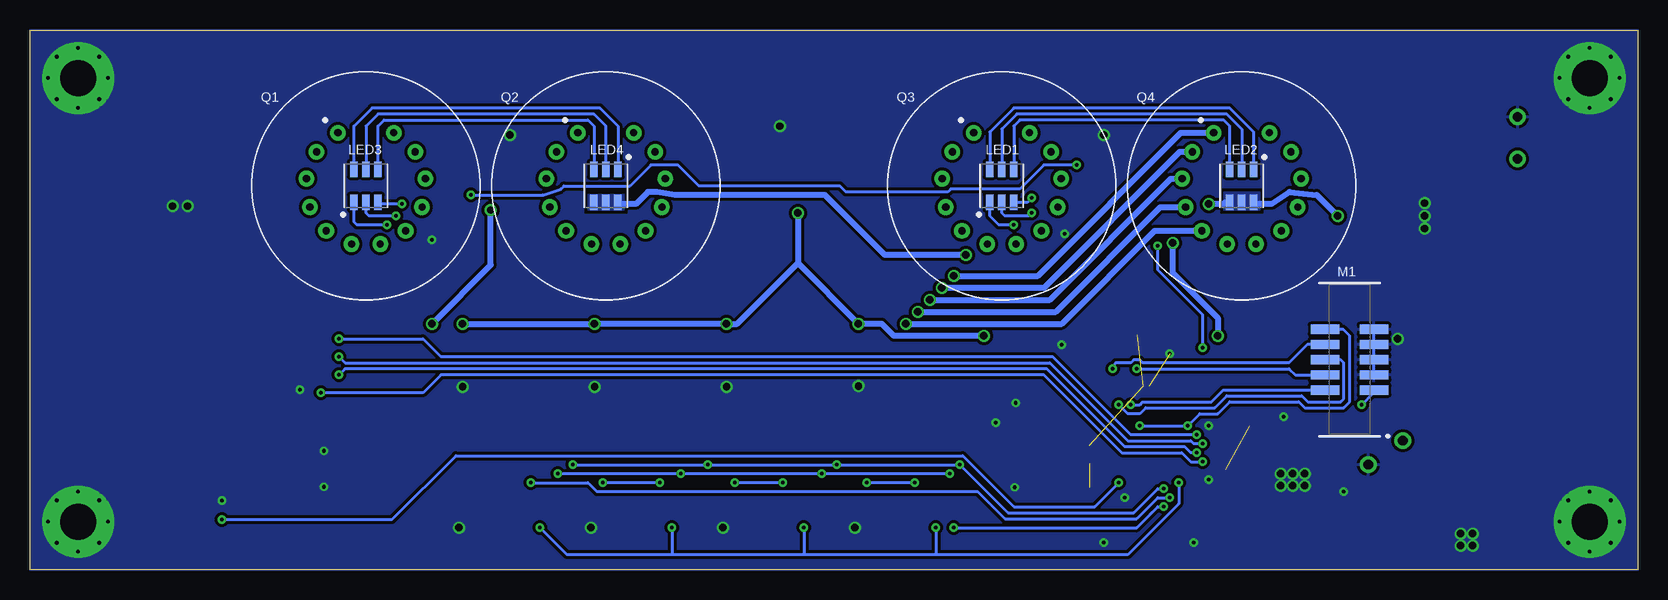
[diagram p6: board, bottom side, seen from below]

Size 134 x 45 mm. Coordinates in mm from the lower left corner, seen from the top.
Outline: 0,0 134,0 134,45 0,45 0,0
Copper layers (1*16): Top 0.035mm / dielectric 1.5mm / Bottom 0.035mm
Design rules "custom01 *": minimum track width 0.2mm, minimum drill 0.3mm, track to track 0.2mm, track to pad 0.2mm, pad to pad 0.2mm, via to via 0.2mm, smd to smd 0.2mm, copper to edge 0mil, drill to drill 0.1mm, minimum pad ring 0.2mm, minimum via ring 0.2mm, stop-mask expansion 0.05mm, vias tented up to drill 0.6mm, thermal gap 0.25mm

### Footprints (pad centres in the part's own frame; a part is rotated, then mirrored left to right if it is on the bottom)
CAPC1608X80N = smd 0.788 x 0.929: 1 -0.821,0; 2 0.821,0
CAPC2012X145N = smd 0.765 x 1.465: 1 -1.075,0; 2 1.075,0
CAPPRD350W60D800H1150B = drill 0.8 pad 1.4: 1 -1.75,0; 2 1.75,0
CAPC3216X170N = smd 1.165 x 1.815: 1 -1.475,0; 2 1.475,0
SOD3716X135N = smd 1.159 x 0.839: 1 -1.731,0; 2 1.731,0
DIOM5436X245N = smd 2.211 x 2.126: 1 -2.203,0; 2 2.203,0
SODFL3517X110N = smd 0.909 x 1.07: 1 -1.603,0; 2 1.603,0
SOD2512X110N = smd 1.059 x 0.497: 1 -1.178,0; 2 1.178,0
SOIC127P600X175-16N = smd 1.968 x 0.599: 1 -2.473,4.445; 2 -2.473,3.175; 3 -2.473,1.905; 4 -2.473,0.635; 5 -2.473,-0.635; 6 -2.473,-1.905; 7 -2.473,-3.175; 8 -2.473,-4.445; 9 2.473,-4.445; 10 2.473,-3.175; 11 2.473,-1.905; 12 2.473,-0.635; 13 2.473,0.635; 14 2.473,1.905; 15 2.473,3.175; 16 2.473,4.445
SOIC127P600X175-8N = smd 1.585 x 0.602: 1 -2.665,1.905; 2 -2.665,0.635; 3 -2.665,-0.635; 4 -2.665,-1.905; 5 2.665,-1.905; 6 2.665,-0.635; 7 2.665,0.635; 8 2.665,1.905
SOT127P700X180-6N = smd 1.936 x 0.61: 1 -2.989,2.54; 2 -2.989,1.27; 3 -2.989,0; 4 -2.989,-1.27; 5 -2.989,-2.54 | smd 1.936 x 3.189: 6 2.989,0
QFP50P1200X1200X160-64N = smd 1.559 x 0.28: 1 -5.678,3.75; 2 -5.678,3.25; 3 -5.678,2.75; 4 -5.678,2.25; 5 -5.678,1.75; 6 -5.678,1.25; 7 -5.678,0.75; 8 -5.678,0.25; 9 -5.678,-0.25; 10 -5.678,-0.75; 11 -5.678,-1.25; 12 -5.678,-1.75; 13 -5.678,-2.25; 14 -5.678,-2.75; 15 -5.678,-3.25; 16 -5.678,-3.75; 33 5.678,-3.75; 34 5.678,-3.25; 35 5.678,-2.75; 36 5.678,-2.25; 37 5.678,-1.75; 38 5.678,-1.25; 39 5.678,-0.75; 40 5.678,-0.25; 41 5.678,0.25; 42 5.678,0.75; 43 5.678,1.25; 44 5.678,1.75; 45 5.678,2.25; 46 5.678,2.75; 47 5.678,3.25; 48 5.678,3.75 | smd 0.28 x 1.559: 17 -3.75,-5.678; 18 -3.25,-5.678; 19 -2.75,-5.678; 20 -2.25,-5.678; 21 -1.75,-5.678; 22 -1.25,-5.678; 23 -0.75,-5.678; 24 -0.25,-5.678; 25 0.25,-5.678; 26 0.75,-5.678; 27 1.25,-5.678; 28 1.75,-5.678; 29 2.25,-5.678; 30 2.75,-5.678; 31 3.25,-5.678; 32 3.75,-5.678; 49 3.75,5.678; 50 3.25,5.678; 51 2.75,5.678; 52 2.25,5.678; 53 1.75,5.678; 54 1.25,5.678; 55 0.75,5.678; 56 0.25,5.678; 57 -0.25,5.678; 58 -0.75,5.678; 59 -1.25,5.678; 60 -1.75,5.678; 61 -2.25,5.678; 62 -2.75,5.678; 63 -3.25,5.678; 64 -3.75,5.678
PCB_TERMINAL_PAD = smd 4 x 2: 1 0,0
MOLEX_501568-0607 = smd 1.5 x 0.6: 1 -2.825,-2.5; 2 -2.825,-1.5; 3 -2.825,-0.5; 4 -2.825,0.5; 5 -2.825,1.5; 6 -2.825,2.5 | smd 1.8 x 1.2: 7 1.075,-3.8; 8 1.075,3.8
INDM120120X600N = smd 3.656 x 5.012: 1 -4.925,0; 2 4.925,0
CLX6E-FKC = smd 1.27 x 0.635: 1 -1.375,1; 2 -1.375,0; 3 -1.375,-1; 4 1.375,-1; 5 1.375,0; 6 1.375,1
JTAG-ARM-10PIN-PLACEHOLDER = smd 0.76 x 2.4: 01 -2.54,-2.035; 02 -2.54,2.035; 03 -1.27,-2.035; 04 -1.27,2.035; 05 0,-2.035; 06 0,2.035; 07 1.27,-2.035; 08 1.27,2.035; 09 2.54,-2.035; 10 2.54,2.035
MOUNTING_HOLE_3MM = drill 3 pad 6: 0 0,0 | drill 0.3: 1 -2.5,0; 2 -1.768,-1.768; 3 0,-2.5; 4 1.768,-1.768; 5 2.5,0; 6 1.768,1.768; 7 0,2.5; 8 -1.768,1.768
S8421-45R = smd 2.6 x 3.5: 1 0,9.75 | smd 3.6 x 3: 2 0,-12.9
NIXIE-IN-8-2 = drill 0.6 pad 1.3: 1 -2.326,4.426; 2 -4.116,2.838; 3 -4.964,0.601; 4 -4.674,-1.775; 5 -3.314,-3.744; 6 -1.195,-4.855; 7 1.198,-4.854; 8 3.316,-3.742; 9 4.675,-1.772; 10 4.963,0.603; 11 4.115,2.841; 12 2.323,4.427
TO230P990X240-3N = smd 2.643 x 1.225: 1 -4.232,2.3; 3 -4.232,-2.3 | smd 6.613 x 5.58: 4 2.247,0
SOT95P230X110-3N = smd 1.059 x 0.609: 1 -1.078,0.95; 2 -1.078,-0.95; 3 1.078,0
RESC1608X50N = smd 0.779 x 0.929: 1 -0.825,0; 2 0.825,0
RESC3216X70N = smd 0.929 x 1.815: 1 -1.55,0; 2 1.55,0
RESC6331X65N = smd 1.07 x 3.27: 1 -3.055,0; 2 3.055,0
RESC3225X60N = smd 1.085 x 2.715: 1 -1.515,0; 2 1.515,0
22A = smd 1.1 x 1.6: P$1 1.2,-1.45; P$3 -1.2,-1.45 | smd 1.6 x 1.6: P$2 0,1.45
OSCCC320X250X100N = smd 1.312 x 1.112: 1 -1.2,-0.95; 2 1.2,-0.95; 3 1.2,0.95; 4 -1.2,0.95
OSCCC320X150X90N = smd 1.1 x 1.8: 1 -1.3,0; 2 1.3,0

### Placement (x,y rotation side)
C1  96.25,3.5 0 top
C2  85.25,3.5 0 top
C3  74.25,3.5 0 top
C4  63.25,3.5 0 top
C5  41.5,35.5 90 top
C6  39,18 180 top
C7  29.5,2.25 180 top
C8  24.5,4.5 90 top
C9  52.25,11.75 90 top
C10  49.75,14.5 0 top
C11  51.05,8.15 0 top
C12  51.05,5.55 0 top
C13  21,9.75 325 top
C14  10,36 90 top
C15  19.5,29.25 90 top
C16  18.5,17.25 0 top
C17  17.75,19.25 0 top
C18  95.5,35.5 90 top
C19  39,2.25 180 top
C20  31.5,13.75 180 top
C21  42.5,2.25 0 top
C22  31.5,12 180 top
C23  119.5,5 90 top
C24  110.25,16.25 180 top
C25  110.25,17.75 180 top
D1  70,35.25 90 top
D2  6.5,29.75 180 top
D3  15.5,5.5 180 top
D4  48,20 180 top
IC1  93.5,16 90 top
IC2  82.5,16 90 top
IC3  71.5,16 90 top
IC4  60.5,16 90 top
IC5  90.96,8 270 top
IC6  79.96,8 270 top
IC7  68.96,8 270 top
IC8  57.96,8 270 top
IC9  43.5,30 90 top
IC10  97.5,30 90 top
IC11  28.75,7 90 top
IC13  17.5,24.25 90 top
IC14  40,9.6 0 top
J1  11,5.5 0 top
J2  11,2.5 0 top
J3  108.2,9.4 180 top
L1  9.3,13.95 180 top
LED1  53,32 90 bottom
LED2  33,32 270 bottom
LED3  106,32 90 bottom
LED4  86,32 270 bottom
M1  24,17.5 90 bottom
MT1  4,41 0 top
MT2  130,41 0 top
MT3  130,4 0 top
MT4  4,4 0 top
PS1  121.5,23 0 top
Q1  106,32 0 bottom
Q2  86,32 0 bottom
Q3  53,32 0 bottom
Q4  33,32 0 bottom
Q7  8.5,24 180 top
Q8  48,17.5 180 top
R1  46.77,3.4 0 top
R2  15,29.5 180 top
R3  43.25,18.75 90 top
R4  41.75,18.75 90 top
R5  66.65,36.46 90 top
R6  22.25,30.5 90 top
R7  22.25,20.25 90 top
R8  121.5,5 270 top
R9  102.25,16.25 180 top
R10  101,38.75 90 top
R11  81,38.75 90 top
R12  48,38.75 90 top
R13  28,38.75 90 top
R14  102.25,17.75 180 top
R15  33,3 270 top
R16  22.25,24.25 180 top
R17  50.45,17.5 90 top
R18  52.05,17.5 270 top
R19  97,35.5 270 top
R20  43,35.5 270 top
R21  47.38,11.75 270 top
R22  106.25,16.25 180 top
R23  106.25,17.75 180 top
R24  102.25,19.25 0 top
R25  106.25,19.25 0 top
R26  71.5,3.5 0 top
Y1  49.75,11.75 90 top
Y2  48.5,6.85 270 top

### Tracks (layer width: path | path; a pad name or v marks a point on that pad's centre or on a via)
3V3  (via drill 0.3, 0.6)  (3 unrouted)
  Top 0.25: 60.83,2.05 60.88,2 | IC5.10 87.78,4.46 88.5,3.75 88.5,2 | IC6.10 76.78,4.46 77.5,3.75 77.5,2 | IC7.10 65.78,4.46 66.5,3.75 66.5,2 | IC8.10 54.78,4.29 54,3.5 54,2 | IC14.26 40.75,2.25 | 40.75,2.25 40.75,1 | C19.1 40.75,2.25 | C21.1 40.75,2.25 | R1.2 47.6,2.02 47.62,2 | IC14.2 32.47,12.85 32.32,13 | 32.32,14.75 28.25,14.75 27.25,13.75 v23,13.75 | R24.1 100.5,19.25 | R14.2 100.5,17.75 | R9.2 100.5,16.25 | R26.2 C3.1
  Top 0.5: 62.5,2 60.88,2 54,2 47.62,2 46.25,2 45.25,1 40.75,1 35.5,1 34.33,2.17 R15.2 30.4,2.17 C7.1 30.02,2.55 IC11.4 30.02,5.27 30.5,5.75 31.75,5.75 32.32,6.32 C22.1 32.32,13 C20.1 32.32,14.75 32.32,16.82 v35,19.5 41.67,19.5 R4.2 R3.2 | 62.5,2 66.5,2 73.5,2 | 73.5,2 77.5,2 84.5,2 | IC8.16 62.43,5.5 C4.1 62.43,2.07 62.5,2 | 84.5,2 88.5,2 94.5,2 95.43,2.93 C1.1 95.43,5.5 IC5.16 98.03,5.53 100.5,8 100.5,16.25 100.5,17.75 100.5,19.25 v100.5,20.5 | IC7.16 73.43,5.5 C3.1 73.43,2.07 73.5,2 | IC6.16 84.43,5.5 C2.1 84.43,2.07 84.5,2 | v38.75,27.25 38.75,29 41.59,31.84 IC9.8 41.59,34.58 C5.1 | C18.1 95.59,34.58 IC10.8 v95.59,29.97
  Bottom 0.25: v23,13.75 21.96,14.79 M1.01
  Bottom 0.5: v38.75,27.25 38.75,24.75 35,21 v35,19.5 | v95.59,29.97 95.59,25.41 v100.5,20.5
12V  (via drill 0.6)
  Top 0.5: v56,26.25 55.5,25.75 38.25,25.75 37.5,26.5 37.5,28.86 36.3,29.72 36.25,29.75 35.75,30.25 v35.75,30.5 | IC13.2 16.86,19.31 C17.1 16.93,17.34 C16.1 14.22,14.45 L1.1 | v25,29.5 25,18 18.5,11.5 | IC11.2 IC11.1 26.25,3.97 26.25,3.5 26.07,3.68 C8.1 21.07,3.68 20,4.75
  Bottom 0.5: LED2.6 31.88,30.5 30.5,30.5 29,31.5 26.75,31.25 v25,29.5 | LED2.4 34.38,30.62 34.5,30.5 v35.75,30.5 | v56,26.25 62.75,26.25 67.75,31.25 80.25,31.25 81.75,31.5 82.5,31.5 83.5,30.5 84.88,30.5 LED4.6
  pour Bottom (isolate 0.5, no thermals): 31.5,31.5 31.5,30 34.5,30 34.5,31.5
  pour Bottom (isolate 0.5, no thermals): 84.5,31.5 84.5,30 87.5,30 87.5,31.5
  pour Top (no thermals): 16.5,4.5 16.5,7.5 12.5,11.5 12.5,14.5 17,14.5 20.25,11.25 20.25,4.5
!JTAG_RST  (via drill 0.3)
  Top 0.25: IC11.5 31.48,3.83 R15.1 34.08,3.83 37.5,7.25 v37.5,12 | IC14.38 44.68,8.35 43.75,9.28 43.75,9.75 v41.5,12
  Bottom 0.25: M1.10 24.54,20.04 24,19.5 24,14 24.5,13.5 27.75,13.5 28.25,14 34,14 35,13 36.5,13 v37.5,12 v41.5,12
!WAKE
  Top 0.25: IC14.32 45.43,3.92 R1.1
CS
  Top 0.5: Q7.3 13.35,26.91 | 13.35,26.91 IC13.8 | R2.2 13.45,27.02 13.35,26.91
DTA_COM  (via drill 0.6)
  Top 0.25: 70.08,33.38 D1.1
  Top 0.5: IC4.9 v64.94,20.5 v64.95,20.5 | IC3.9 v75.95,20.5 | IC2.9 v86.94,20.5 v86.95,20.5 | IC1.9 v97.95,20.5 | v70,29.75 70,33.31 70.08,33.38 | R5.1 69.89,33.41 D1.1 | D4.1 49.68,19.5 v54.5,19.5
  Bottom 0.5: v97.95,20.5 v86.95,20.5 v75.95,20.5 75.05,20.5 70,25.55 | v70,29.75 70,25.55 | 70,25.55 v64.95,20.5 63,20.5 62,19.5 v54.5,19.5
FB
  Top 0.5: IC13.3 18.14,22.79 R16.P$1 21.2,25.7 22.25,26.75 R6.1
GND  (via drill 0.3, 0.6)  (2 unrouted)
  Top 0.25: C9.2 52.25,13.5 v51.85,13.9 51.25,14.5 C10.2 | C11.2 51.9,8.12 v51.9,6.85 51.9,5.58 C12.2 | C6.2 v39,18 | J3.6 v109.5,6.9 | R17.2 49.2,18.32 Q8.2 48.3,18.45 v48,18.75 | IC14.27 41.27,3.94 41.27,5.02 42.25,6 v42.75,6 43.75,6 44.6,6.85 IC14.35 | IC9.4 47.09,27.34 v47.75,28 | v100.5,27.5 100.33,27.34 IC10.4 | C19.2 v37,2.25 | C21.2 v44.5,2.25 | 30.68,12.75 C20.2 30.75,13.82 | 30.68,12.75 C22.2 | C8.2 v24.5,6.5 | IC7.8 64.52,11.77 64.94,12.2 IC4.8 | IC6.8 75.52,11.77 75.94,12.2 IC3.8 | IC5.8 86.52,11.77 86.94,12.2 IC2.8 | IC8.8 53.5,10.49 v53.5,12.25 | C23.2 119.43,5.75 v118,5.75 | 30.68,12.75 v29.5,12.75 | IC14.12 35.4,7.85 v35.75,7.5 | IC14.3 35.4,12.35 v35.75,12 | J3.3 v109.5,9.9 | C25.1 C24.1 111.07,15.43 v111.5,15
  Top 0.5: v71.5,36.98 D1.2 | D1.2 | v64.94,15.3 IC4.8 | v75.94,15.25 IC3.8 | IC2.8 v86.94,15.25 | v97.94,15.25 IC1.8 | C4.2 v65.25,3.5 | C3.2 v76.25,3.5 | C2.2 v87.25,3.5 | C1.2 v98.25,3.5 | C7.2 28.75,2.32 IC11.3 v28.75,7 | v94,36.25 94.07,36.32 C18.2 R19.1 | C5.2 R20.1 44.42,36.33 v44.5,36.25 | C16.2 20,17.27 v20,19.25 | v20,19.25 C17.2 | v20,19.25 22.07,19.25 R7.1 | IC13.4 19.41,20.59 20,20 v20,19.25 | C15.2 18.4,30.07
  Bottom 0.25: M1.03 M1.05 M1.07 M1.09
  other vias: 120.88,30.3 122.12,30.3 13.75,3 14.75,3 13.75,2 14.75,2 27.75,8 27.75,7 29.75,8 29.75,7 28.75,8 17.75,30.55 17.75,29.5 17.75,28.45
  pour Top (no thermals): 120.25,32.95 120.25,29.7 122.75,29.7 122.75,32.95
  pour Bottom (isolate 0.25, rank 2): 0,45 0,0 134,0 134,45
  pour Top: 9,3.5 15.5,3.5 15.5,1.5 9,1.5
  pour Top (no thermals): 30.5,6.5 30.5,11 27,11 27,6.5
  pour Top (no thermals): 16.6,26.2 16.6,31 18.4,31 18.4,26.2
HV
  Top 0.5: R5.2 66.65,40.27
  Top 1: R13.2 25.77,40.27 23.5,38 23.5,34.5 | R6.2 23.05,33.55
  Top 1.085: R13.2 R12.2 66.65,40.27 R11.2 R10.2
  pour Top (no thermals): 7.6,28.7 7.6,33.2 9.3,34.9 9.6,35.2 16.1,35.2 23.8,35.2 23.8,33.1 10.9,33.1 9.8,32 9.8,28.7
JTAG_TCK  (via drill 0.3)
  Top 0.25: IC14.52 42.25,16.25 v41.75,16.75 R4.1
  Bottom 0.25: M1.04 28.54,16.23 29.05,16.75 v41.75,16.75
JTAG_TDI  (via drill 0.3)
  Top 0.25: v43.75,16.75 43.25,16.25 IC14.50
  Bottom 0.25: M1.08 27.54,18.77 29.05,17.25 41.25,17.25 41.5,17.5 42,17.5 42.25,17.25 43.5,17.25 43.75,17 v43.75,16.75
JTAG_TDO  (via drill 0.3)
  Top 0.25: v43.25,13.75 43.75,14.25 IC14.49
  Bottom 0.25: M1.06 24.75,17.5 24.5,17.25 24.5,14.25 24.75,14 27.5,14 28,14.5 34.25,14.5 35.25,13.5 41,13.5 41.5,13 42.5,13 v43.25,13.75
JTAG_TMS  (via drill 0.3)
  Top 0.25: v42.25,13.75 42.75,14.25 IC14.51 42.75,16.75 43.25,17.25 R3.1
  Bottom 0.25: v42.25,13.75 41.5,13.75 41.29,13.96 35.53,13.96 34.53,14.96 M1.02
LED_SDI  (via drill 0.3)
  Top 0.25: v40,27 40,29 40.5,29.5 42,29.5 44.13,31.64 IC9.6 | IC14.64 v36.25,18.5
  Bottom 0.25: v36.25,18.5 36.25,21.25 40,25 v40,27
MCU_LS  (via drill 0.3)
  Top 0.25: IC14.6 35.35,10.85 35.75,11.25 v36.75,11.25 | J3.5 111.9,7.9 112.5,8.5 112.5,18 111.25,19.25 v108.25,19.25 R25.2
  Bottom 0.25: v36.75,11.25 42.25,11.25 48.75,17.75 99.75,17.75 101.25,19.25 v108.25,19.25
MCU_PWM  (via drill 0.3)
  Top 0.25: IC14.1 37.15,13.35 38.25,12.25 v38.25,7.25 | v91.5,3.5 91.59,3.6 IC5.13 | IC6.13 80.59,3.6 v80.5,3.5 | IC7.13 69.59,4.09 69.5,4 v69.5,3.5 R26.1 | IC8.13 58.59,3.6 v58.5,3.5
  Bottom 0.25: v38.25,7.25 38.25,5.5 42.5,1.25 58.5,1.25 | v91.5,3.5 89.25,1.25 80.5,1.25 | 58.5,1.25 69.5,1.25 | 69.5,1.25 80.5,1.25 | v80.5,3.5 80.5,1.25 | v69.5,3.5 69.5,1.25 | v58.5,3.5 58.5,1.25
MCU_QEA  (via drill 0.3)
  Top 0.25: v36.75,9.75 36,9.75 35.9,9.85 IC14.8 | R22.1 v108.25,16.25 C24.2
  Bottom 0.25: v36.75,9.75 37.25,9.75 37.75,10.25 42.75,10.25 49.25,16.75 107.75,16.75 v108.25,16.25
MCU_QEB  (via drill 0.3)
  Top 0.25: IC14.7 36.1,10.35 v36.25,10.5 | R23.1 v108.25,17.75 C25.2
  Bottom 0.25: v108.25,17.75 107.75,17.25 49,17.25 42.5,10.75 37.25,10.75 37,10.5 v36.25,10.5
MCU_SW  (via drill 0.3)
  Top 0.25: v36.25,9 35.75,9 35.4,9.35 IC14.9 | v109.75,14.75 110.25,14.75 111.03,13.97 J3.1
  Bottom 0.25: v36.25,9 37.25,9 38,9.75 43,9.75 49.5,16.25 99.75,16.25 101.25,14.75 v109.75,14.75
MCU_VBAT  (via drill 0.3)
  Top 0.25: R8.2 C23.1 v118,4.18 | v43.25,7.25 43.85,7.85 IC14.37
  Bottom 0.25: v43.25,7.25 45.25,5.25 52,5.25 56.25,9.5 98.5,9.5 103.82,4.18 v118,4.18
MCU_VDDC
  Top 0.25: C6.1 40.25,17.82 IC14.56 IC14.25
N$1
  Top 0.25: IC5.15 94.14,6.63 96.67,9.18 IC1.7
N$2
  Top 0.25: IC1.6 IC5.1
N$3
  Top 0.25: IC1.5 IC5.2
N$4
  Top 0.25: IC1.4 IC5.3
N$5
  Top 0.25: IC1.3 IC5.4
N$6
  Top 0.25: IC1.2 IC5.5
N$7
  Top 0.25: IC1.1 IC5.6
N$8  (via drill 0.3)
  Top 0.25: v81.5,7.25 81.86,6.88 IC6.14 | v86.25,7.25 86.52,6.99 IC5.9
  Bottom 0.25: v81.5,7.25 v86.25,7.25
N$9
  Top 0.5: IC1.10 96.67,21.68 97.5,22.5 107.5,22.5 113.5,28.5 113.5,34 111.07,36.43 Q1.1
N$10
  Top 0.5: IC1.11 95.41,21.91 97,23.5 107,23.5 112.5,29 112.5,33.5 111.16,34.84 Q1.2
N$11
  Top 0.5: IC1.12 94.14,22.14 96.5,24.5 105,24.5 106,25.5 106,30.73 Q1.11
N$12
  Top 0.5: Q2.1 91.57,36.43 94,34 94,25 92.86,23.86 IC1.13
N$13
  Top 0.5: IC1.14 91.59,24.09 93,25.5 93,33.5 91.66,34.84 Q2.2
N$14
  Top 0.5: IC1.15 90.33,24.32 92,26 92,31.56 Q2.3
N$15
  Top 0.5: IC1.16 89.06,25.05 90.75,26.75 90.75,30.15 Q2.4
N$16  (via drill 0.3)
  Top 0.25: v71.25,7.25 70.86,6.87 IC7.14 | v75.25,7.25 75.52,6.99 IC6.9
  Bottom 0.25: v71.25,7.25 v75.25,7.25
N$17
  Top 0.5: IC2.10 85.67,23.18 89.31,26.81 Q2.5
N$18
  Top 0.5: IC2.11 84.41,24.36 Q2.6
N$19
  Top 0.5: Q2.7 83.14,25.48 IC2.12
N$20
  Top 0.5: IC2.13 81.86,21.14 81.33,21.68 Q2.9
N$21
  Top 0.5: IC2.14 80.59,20.41 80,21 80,31.57 Q2.10
N$22
  Top 0.5: IC2.15 79.33,20.18 79,20.5 79,33 80.84,34.84 Q2.11
N$23
  Top 0.25: IC6.15 83.14,6.63 85.42,8.93 85.42,12.03 85.67,12.28 IC2.7
N$24  (via drill 0.3)
  Top 0.25: v60.25,7.25 59.87,6.87 IC8.14 | v64.25,7.25 64.52,6.99 IC7.9
  Bottom 0.25: v60.25,7.25 v64.25,7.25
N$25
  Top 0.25: IC2.6 IC6.1
N$26
  Top 0.25: IC2.5 IC6.2
N$27
  Top 0.25: IC2.4 IC6.3
N$28
  Top 0.25: IC2.3 IC6.4
N$29
  Top 0.25: IC2.2 IC6.5
N$30
  Top 0.25: IC2.1 IC6.6
N$31
  Top 0.25: IC7.15 72.14,6.63 74.42,8.93 74.42,12.03 74.67,12.28 IC3.7
N$32
  Top 0.25: IC3.6 IC7.1
N$33
  Top 0.25: IC3.5 IC7.2
N$34
  Top 0.25: IC3.4 IC7.3
N$35
  Top 0.25: IC3.3 IC7.4
N$36
  Top 0.25: IC3.2 IC7.5
N$37
  Top 0.25: IC3.1 IC7.6
N$38
  Top 0.25: R18.1 52.12,18.25 53.25,18.25 54.78,16.71 IC8.7
N$39  (via drill 0.3)
  Top 0.25: IC9.1 41.59,28.34 43.38,30.12 43.5,30.25 45.5,30.25 46.75,31.5 50,31.5 v50.5,31
  Bottom 0.25: v50.5,31 50.88,30.62 LED1.3
N$40  (via drill 0.3)
  Top 0.25: IC9.3 44.13,28.14 44.75,28.75 48,28.75 48.5,28.25 48.5,27.75 49.25,27 50,27 51.75,28.75 v52,28.75
  Bottom 0.25: v52,28.75 53.25,28.75 54,29.5 LED1.1
N$41  (via drill 0.3)
  Top 0.25: IC9.2 42.87,28.36 43.75,29.25 49,29.25 49.5,29.75 v50.5,29.75
  Bottom 0.25: v50.5,29.75 50.75,29.5 52.75,29.5 53,29.75 LED1.2
N$42  (via drill 0.6)
  Top 0.5: IC4.11 62.41,20.59 61.5,21.5 v60,21.5
  Bottom 0.5: Q4.4 39.77,30.23 48.5,21.5 v60,21.5
N$43  (via drill 0.3)
  Top 0.25: IC10.1 95.59,28.09 97,29.5 99,29.5 100.9,31.4 102.1,31.4 v103,30.5
  Bottom 0.25: v103,30.5 104.88,30.5 LED3.3
N$44
  Top 0.25: IC8.15 61.13,6.63 63.67,9.18 IC4.7
N$45
  Top 0.25: IC4.6 IC8.1
N$46
  Top 0.25: IC4.5 IC8.2
N$47
  Top 0.25: IC4.4 IC8.3
N$48
  Top 0.25: IC4.3 IC8.4
N$49
  Top 0.25: IC4.2 IC8.5
N$50
  Top 0.25: IC8.6 IC4.1
N$51
  Top 0.5: IC2.16 78.06,19.95 67.5,30.5 65,30.5 57.75,37.75 53.75,37.75 53,37 53,35.5 52.34,34.84 Q3.11
N$52
  Top 0.5: IC3.14 69.59,20.91 65,25.5 59.07,25.5 Q3.5
N$53
  Top 0.5: IC3.13 70.86,21.14 65.5,26.5 61.4,26.5 Q3.4
N$54
  Top 0.5: IC3.12 72.14,21.36 66,27.5 63.06,27.5 Q3.3
N$55
  Top 1.085: R10.1 102.87,37.23 Q1.12
N$56
  Top 0.5: IC13.1 15.48,21.7 Q7.1
N$57
  Top 0.5: IC3.11 73.41,21.59 66.5,28.5 64,28.5 57.66,34.84 Q3.2
N$58
  Top 0.5: IC3.10 74.67,21.82 67,29.5 64.5,29.5 57.57,36.43 Q3.1
N$59  (via drill 0.6)
  Top 0.5: IC3.15 68.33,20.68 68,21 64.5,24.5 v57,24.5
  Bottom 0.5: v57,24.5 50,24.5 38.07,36.43 Q4.1
N$60  (via drill 0.6)
  Top 0.5: IC3.16 67.06,20 67.06,20.45 64,23.5 v58,23.5
  Bottom 0.5: v58,23.5 49.5,23.5 38.16,34.84 Q4.2
N$61  (via drill 0.6)
  Top 0.5: IC4.10 63.67,20.82 62,22.5 v59,22.5
  Bottom 0.5: Q4.3 38.9,32.6 49,22.5 v59,22.5
N$62  (via drill 0.6)
  Top 0.5: IC4.12 61.13,20.36 v61,20.5
  Bottom 0.5: Q4.5 38,28.26 40.24,28.26 48,20.5 v61,20.5
N$63
  Top 0.5: IC4.13 59.87,20.14 55.5,24.5 36.84,24.5 Q4.6
N$64
  Top 0.5: IC4.14 58.59,19.91 55,23.5 35.45,23.5 Q4.7
N$65
  Top 0.25: Q8.1 49.2,16.68 R17.1 R18.2
N$66
  Top 0.5: IC4.15 57.33,19.68 54.5,22.5 33,22.5 28.25,27.25 28.25,30.15 Q4.9
N$67
  Top 0.5: IC4.16 56.05,19.47 54.03,21.5 32.5,21.5 27.04,26.96 27.04,31.6 Q4.10
N$68
  Top 0.5: Q8.3 46.92,20 D4.2 46.32,20.5 32,20.5 26,26.5 26,33 27.84,34.84 Q4.11
N$69  (via drill 0.3)
  Top 0.25: IC10.2 96.86,28.61 97.25,29 101.75,29 102.25,29.5 v103.5,29.5
  Bottom 0.25: v103.5,29.5 105.75,29.5 106,29.75 LED3.2
N$71
  Top 0.25: R24.2 R25.1
N$73  (via drill 0.3)
  Top 0.25: IC10.3 98.14,26.36 98.5,26 102.5,26 103.25,26.75 v104.25,28.75
  Bottom 0.25: v104.25,28.75 106.75,28.75 107,29 LED3.1
N$74
  Top 1.085: R11.1 82.87,37.23 Q2.12
N$75
  Top 1.085: R12.1 49.87,37.23 Q3.12
N$76
  Top 1.085: R13.1 29.87,37.23 Q4.12
N$82
  Bottom 0.25: LED3.4 105,37 104.5,37.5 87.5,37.5 87,37 LED4.3
N$83
  Top 0.5: R7.2 R16.P$2 23.45,24 R16.P$3
N$84
  Bottom 0.25: LED4.2 86,37 87,38 105,38 106,37 LED3.5
N$85
  Bottom 0.25: LED4.1 85,37 86.5,38.5 105.5,38.5 107,37 LED3.6
N$86
  Bottom 0.25: LED2.3 34,37 34.5,37.5 51.5,37.5 52,37 LED1.4
N$87
  Bottom 0.25: LED2.2 33,36.75 34.25,38 51.75,38 53,36.75 LED1.5
N$88
  Bottom 0.25: LED2.1 32,36.5 34,38.5 52,38.5 54,36.5 LED1.6
N$89
  Top 0.25: IC14.41 46.8,9.85 47.38,10.43 R21.2
N$90
  Top 0.5: R20.2 42.87,34.54 IC9.7
N$91
  Top 0.5: IC10.7 96.86,34.54 R19.2
N$93  (via drill 0.3)
  Top 0.25: IC9.5 45.41,33.41 45.75,33.75 v46.75,33.75 | v97.25,31.25 97.75,31.25 98.14,31.64 IC10.6
  Bottom 0.25: v46.75,33.75 49.5,33.75 51.5,31.75 57.25,31.75 57.5,31.5 66,31.5 66.5,32 78.25,32 80,33.75 82.25,33.75 84,32 89.5,32 89.75,31.75 91.25,31.25 v97.25,31.25
OSC0
  Top 0.25: IC14.40 50.1,9.35 50.7,9.95 Y1.1 51.87,10.55 C9.1
OSC1
  Top 0.25: R21.1 47.5,12.7 48.55,12.7 Y1.3 48.8,14.37 C10.1
QEA_RAW
  Top 0.25: J3.4 109.35,8.9 108.75,9.5 108.75,13.75 108,14.5 106.5,14.5 105.42,15.57 R22.2 R9.1
QEB_RAW
  Top 0.25: J3.2 109.85,10.9 109.25,11.5 109.25,14 108.25,15 106.75,15 106.25,15.5 106.25,16.93 R23.2 R14.1
REF
  Top 0.5: IC13.5 19.41,28.33 C15.1
SR_RCLK  (via drill 0.3)
  Top 0.25: v57.35,8 57.33,7.97 IC8.12 57.33,3.83 v57,3.5 | v68,8 68.33,7.67 IC7.12 | v79.75,8 79.33,7.58 IC6.12 | v90,8 90.33,7.67 IC5.12 | v39.5,5.25 39.25,5 IC14.23
  Bottom 0.25: v57.35,8 v68,8 v79.75,8 v90,8 | v57,3.5 41.75,3.5 40.62,4.62 40.5,4.75 40,5.25 v39.5,5.25
SR_SER  (via drill 0.3)
  Top 0.25: v92.25,7.25 92.86,6.63 IC5.14 | v39,6 38.75,5.75 IC14.22
  Bottom 0.25: v92.25,7.25 87.5,7.25 86.75,6.5 55,6.5 52.75,4.25 41.75,4.25 40,6 v39,6
SR_SRCLK  (via drill 0.3)
  Top 0.25: IC8.11 56.05,8.3 v56.5,8.75 | v66.75,8.75 67.06,8.45 IC7.11 | v77.5,8.75 78.06,8.2 IC6.11 | v88.75,8.75 89.06,8.45 IC5.11 | v39.5,6.75 38.75,6.75 37.25,5.25 IC14.19
  Bottom 0.25: v88.75,8.75 v77.5,8.75 v66.75,8.75 v56.5,8.75 52.5,4.75 42,4.75 40,6.75 v39.5,6.75
SW
  pour Top (no thermals): 2.5,11.5 2.5,31 6.5,31 6.5,11.5
VBAT
  Top 0.25: R8.1 PS1.2
VSUPP
  Top 1: J1.1 D3.2
XOSC0
  Top 0.25: C12.1 Y2.2 47.7,5.55 46.9,6.35 IC14.34
XOSC1
  Top 0.25: C11.1 Y2.1 47.65,8.15 46.85,7.35 IC14.36